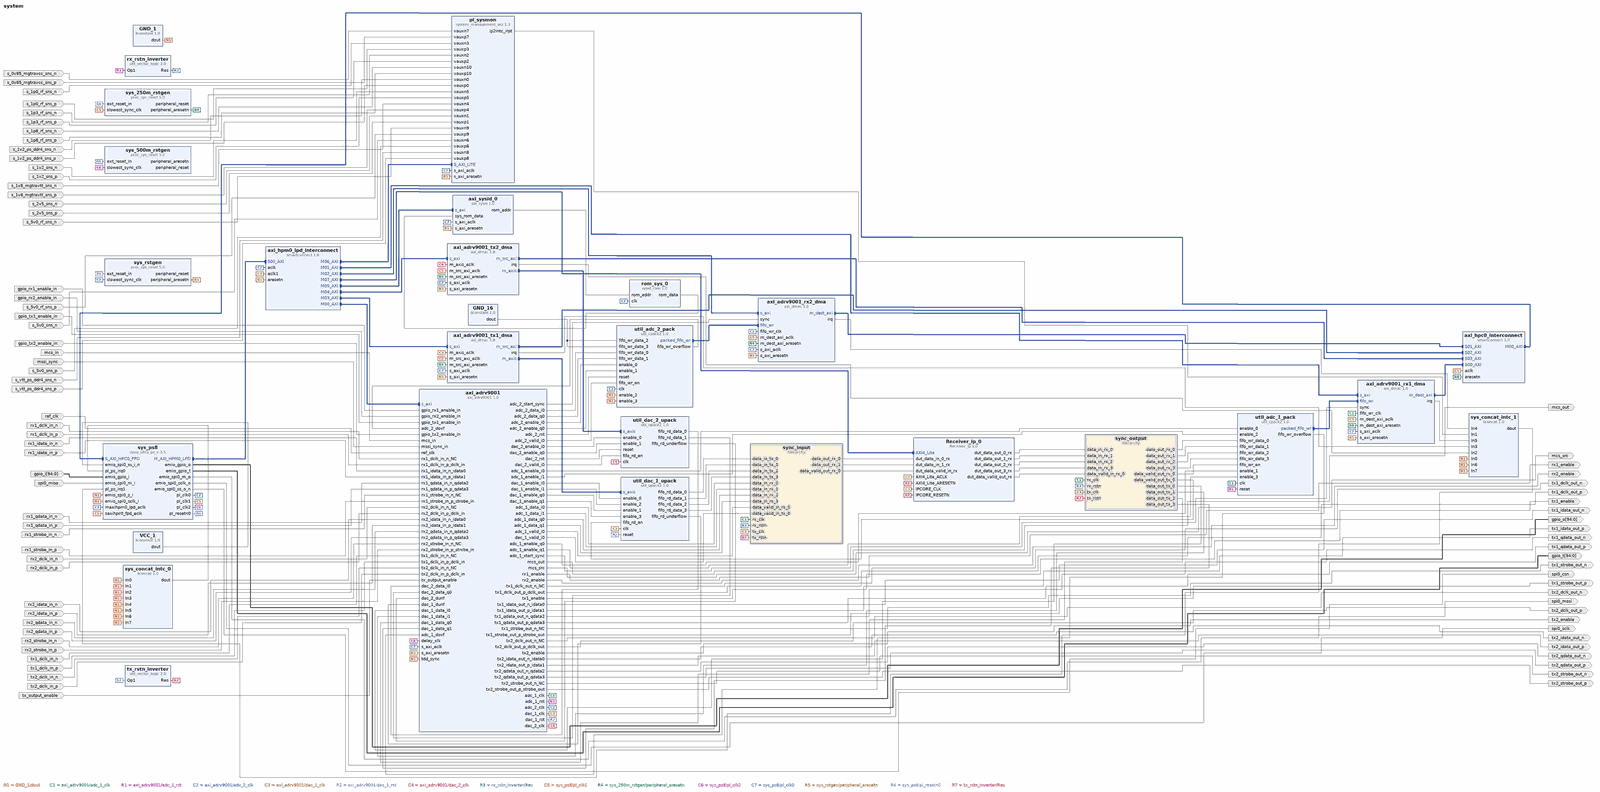
[diagram p0: block diagram of the top level, whole]
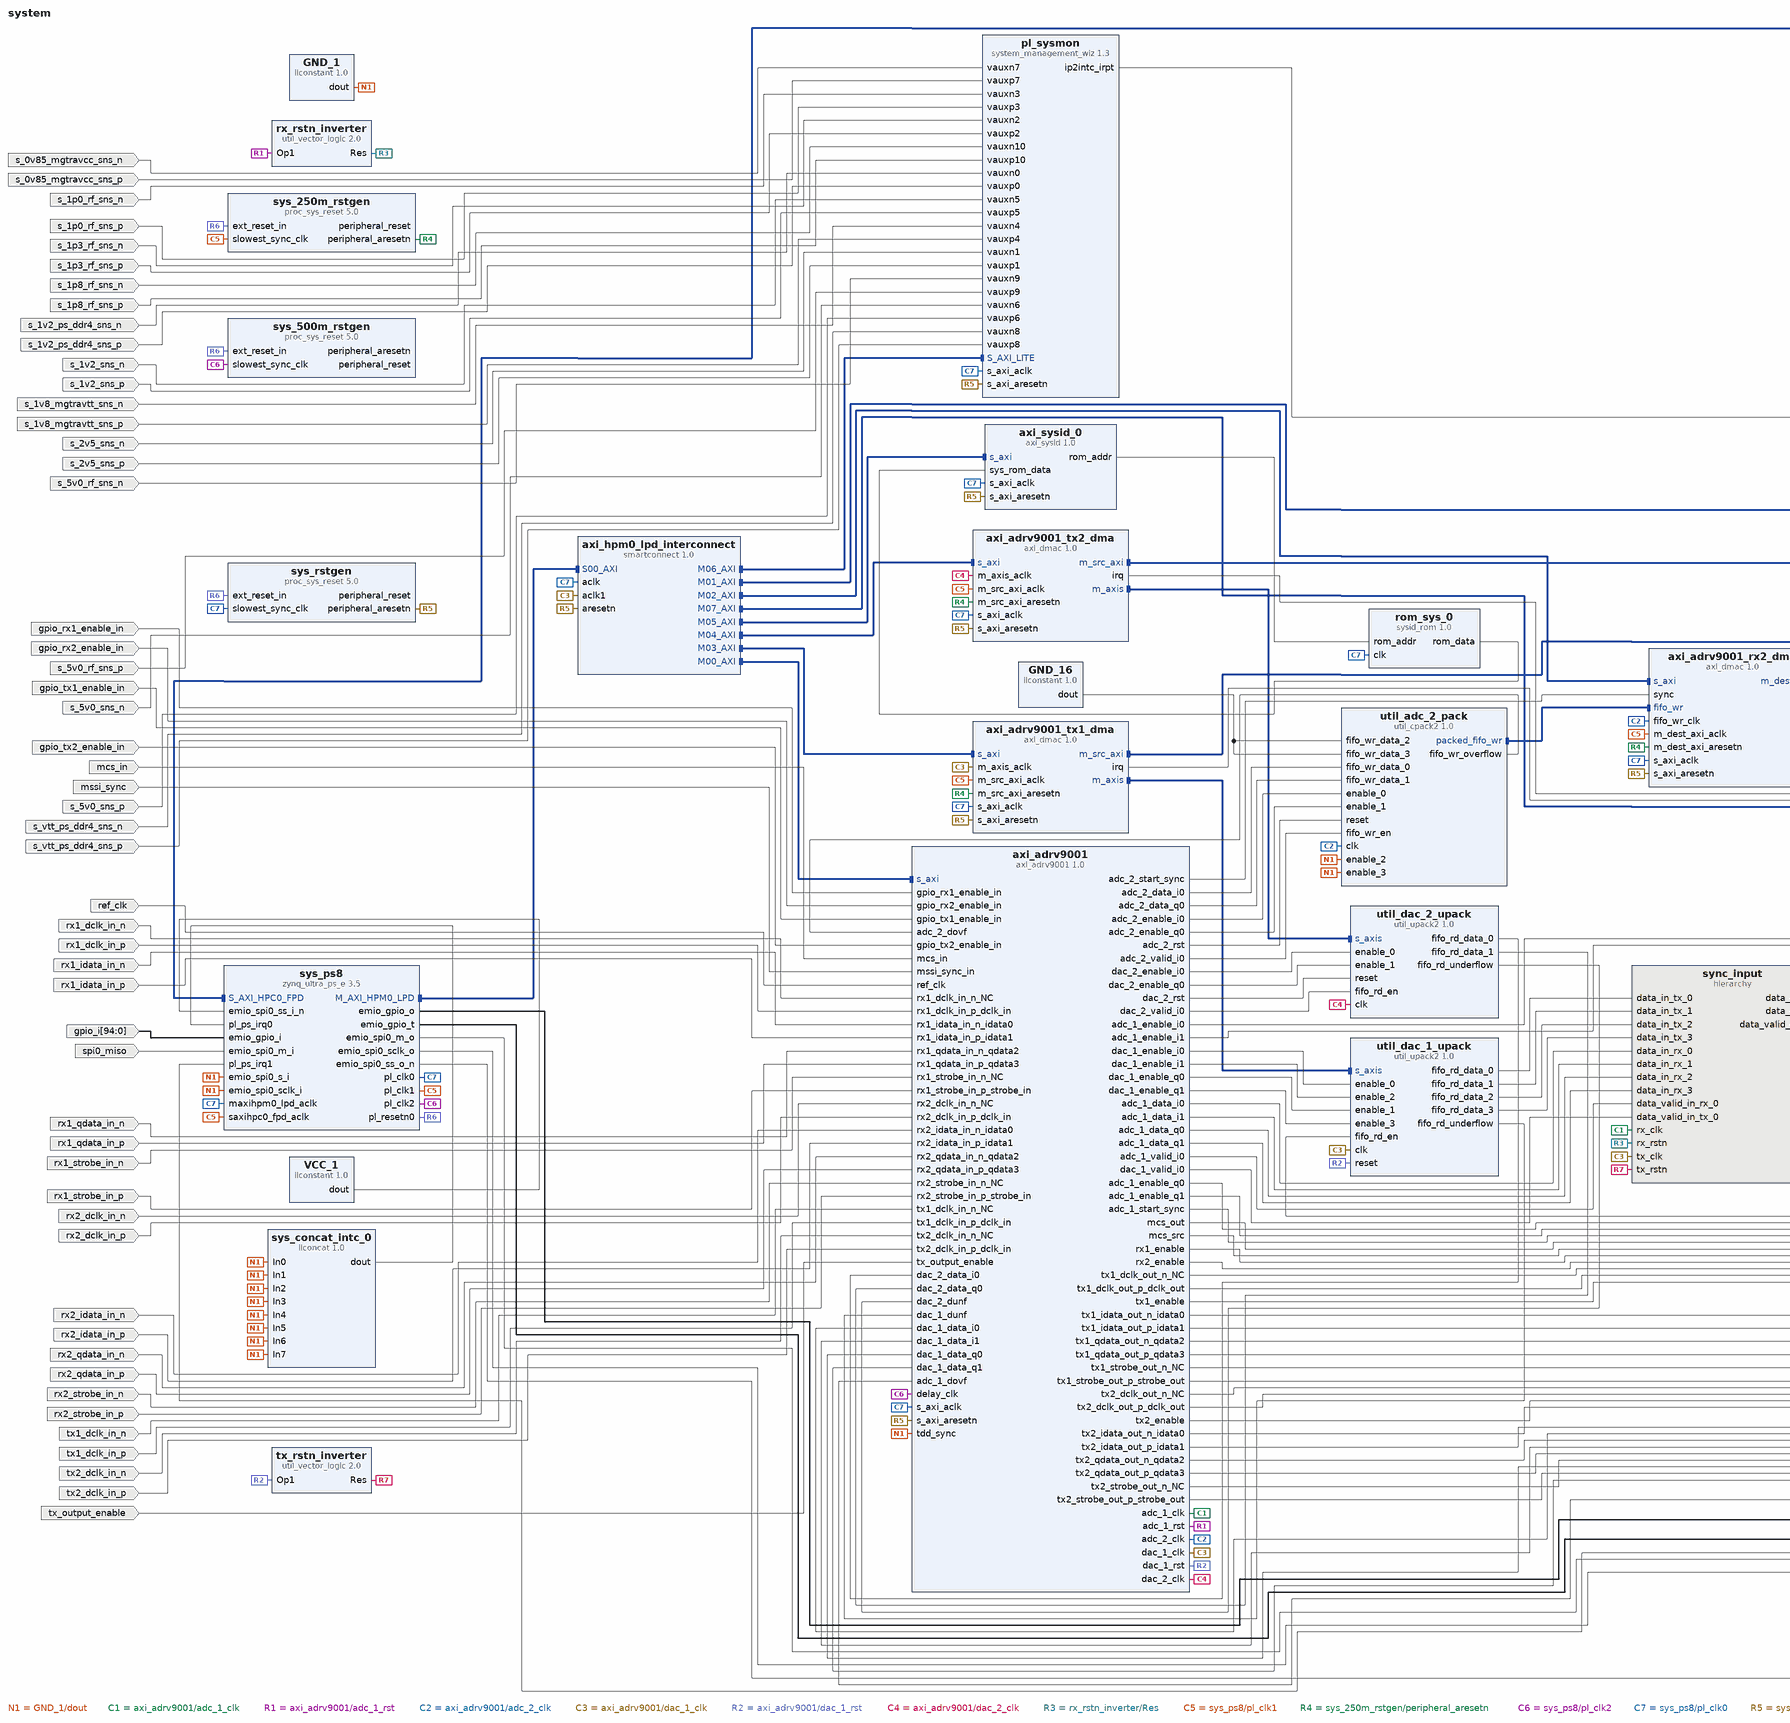
[diagram p1: block diagram of the top level, left part]
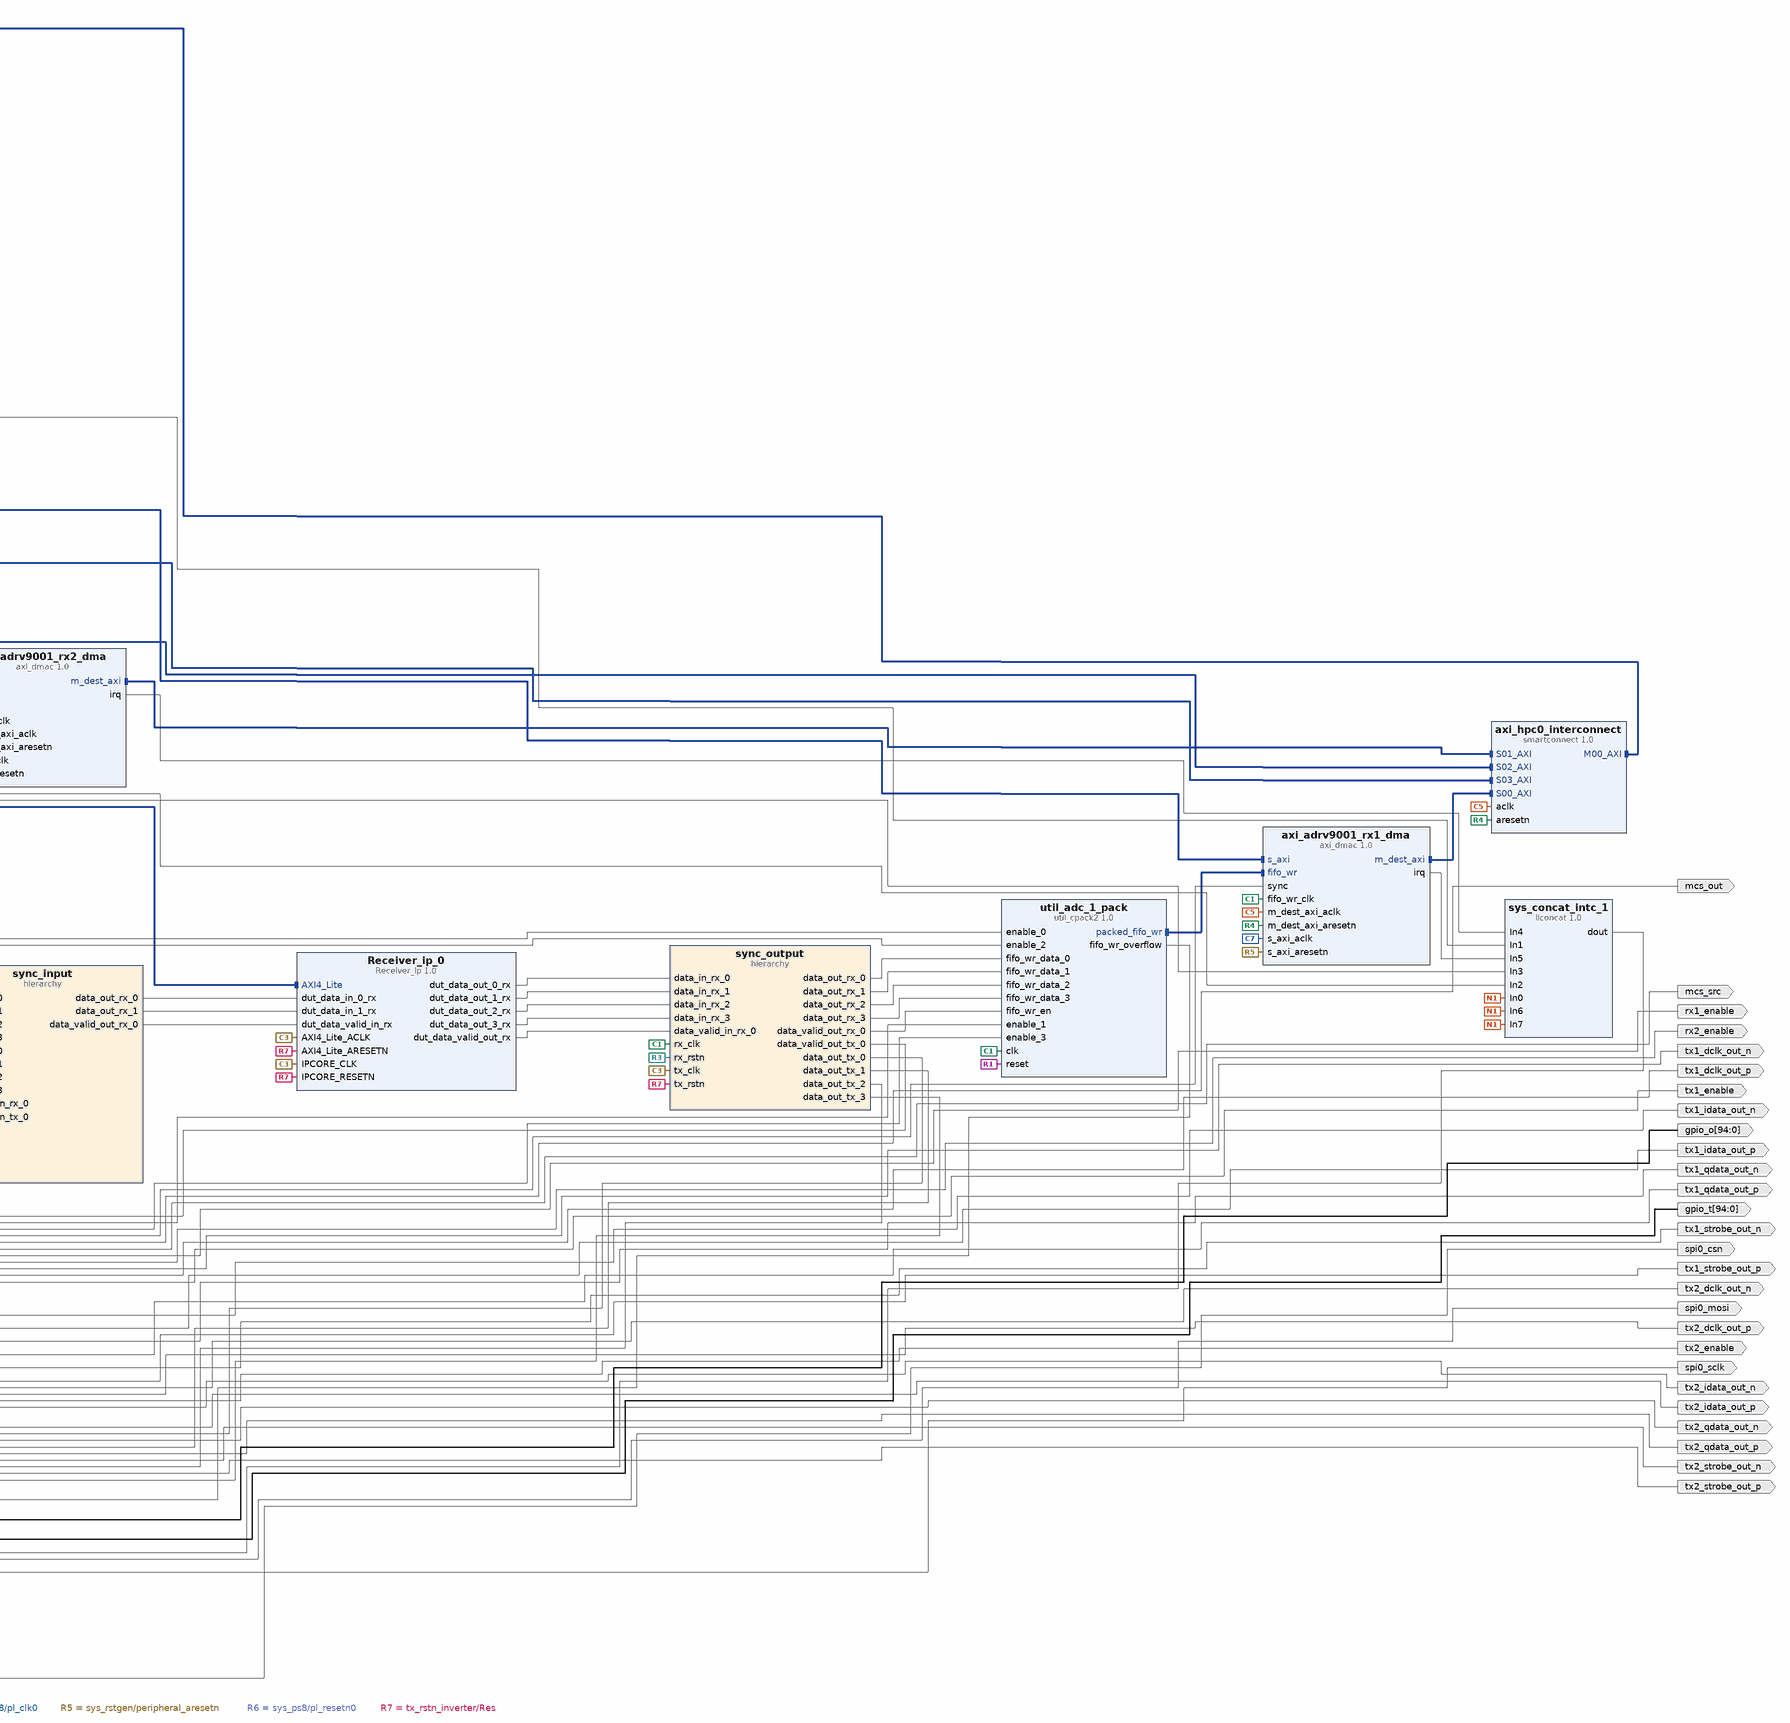
[diagram p2: block diagram of the top level, right part]
# Vivado block design system, xczu3eg-sfva625-2-e, Vivado 2025.1
create_bd_design system

create_bd_port -dir O spi0_csn
create_bd_port -dir O spi0_sclk
create_bd_port -dir O spi0_mosi
create_bd_port -dir I spi0_miso
create_bd_port -dir I -from 94 -to 0 gpio_i
create_bd_port -dir O -from 94 -to 0 gpio_o
create_bd_port -dir O -from 94 -to 0 gpio_t
create_bd_port -dir I rx1_dclk_in_n
create_bd_port -dir I rx1_dclk_in_p
create_bd_port -dir I rx1_idata_in_n
create_bd_port -dir I rx1_idata_in_p
create_bd_port -dir I rx1_qdata_in_n
create_bd_port -dir I rx1_qdata_in_p
create_bd_port -dir I rx1_strobe_in_n
create_bd_port -dir I rx1_strobe_in_p
create_bd_port -dir I rx2_dclk_in_n
create_bd_port -dir I rx2_dclk_in_p
create_bd_port -dir I rx2_idata_in_n
create_bd_port -dir I rx2_idata_in_p
create_bd_port -dir I rx2_qdata_in_n
create_bd_port -dir I rx2_qdata_in_p
create_bd_port -dir I rx2_strobe_in_n
create_bd_port -dir I rx2_strobe_in_p
create_bd_port -dir O tx1_dclk_out_n
create_bd_port -dir O tx1_dclk_out_p
create_bd_port -dir I tx1_dclk_in_n
create_bd_port -dir I tx1_dclk_in_p
create_bd_port -dir O tx1_idata_out_n
create_bd_port -dir O tx1_idata_out_p
create_bd_port -dir O tx1_qdata_out_n
create_bd_port -dir O tx1_qdata_out_p
create_bd_port -dir O tx1_strobe_out_n
create_bd_port -dir O tx1_strobe_out_p
create_bd_port -dir O tx2_dclk_out_n
create_bd_port -dir O tx2_dclk_out_p
create_bd_port -dir I tx2_dclk_in_n
create_bd_port -dir I tx2_dclk_in_p
create_bd_port -dir O tx2_idata_out_n
create_bd_port -dir O tx2_idata_out_p
create_bd_port -dir O tx2_qdata_out_n
create_bd_port -dir O tx2_qdata_out_p
create_bd_port -dir O tx2_strobe_out_n
create_bd_port -dir O tx2_strobe_out_p
create_bd_port -dir O rx1_enable
create_bd_port -dir O rx2_enable
create_bd_port -dir O tx1_enable
create_bd_port -dir O tx2_enable
create_bd_port -dir I gpio_rx1_enable_in
create_bd_port -dir I gpio_rx2_enable_in
create_bd_port -dir I gpio_tx1_enable_in
create_bd_port -dir I gpio_tx2_enable_in
create_bd_port -dir I ref_clk
create_bd_port -dir I mcs_in
create_bd_port -dir O mcs_out
create_bd_port -dir O mcs_src
create_bd_port -dir I mssi_sync
create_bd_port -dir I tx_output_enable
create_bd_port -dir I s_1p0_rf_sns_p
create_bd_port -dir I s_1p0_rf_sns_n
create_bd_port -dir I s_1p8_rf_sns_p
create_bd_port -dir I s_1p8_rf_sns_n
create_bd_port -dir I s_1p3_rf_sns_p
create_bd_port -dir I s_1p3_rf_sns_n
create_bd_port -dir I s_5v0_rf_sns_p
create_bd_port -dir I s_5v0_rf_sns_n
create_bd_port -dir I s_2v5_sns_p
create_bd_port -dir I s_2v5_sns_n
create_bd_port -dir I s_vtt_ps_ddr4_sns_p
create_bd_port -dir I s_vtt_ps_ddr4_sns_n
create_bd_port -dir I s_1v2_ps_ddr4_sns_p
create_bd_port -dir I s_1v2_ps_ddr4_sns_n
create_bd_port -dir I s_0v85_mgtravcc_sns_p
create_bd_port -dir I s_0v85_mgtravcc_sns_n
create_bd_port -dir I s_5v0_sns_p
create_bd_port -dir I s_5v0_sns_n
create_bd_port -dir I s_1v2_sns_p
create_bd_port -dir I s_1v2_sns_n
create_bd_port -dir I s_1v8_mgtravtt_sns_p
create_bd_port -dir I s_1v8_mgtravtt_sns_n

create_bd_cell -type ip -vlnv xilinx.com:ip:zynq_ultra_ps_e:3.5 sys_ps8
set_property -dict [list \
  CONFIG.PSU_BANK_0_IO_STANDARD LVCMOS18 \
  CONFIG.PSU_BANK_1_IO_STANDARD LVCMOS18 \
  CONFIG.PSU_BANK_2_IO_STANDARD LVCMOS18 \
  CONFIG.PSU_BANK_3_IO_STANDARD LVCMOS18 \
  CONFIG.PSU_USB3__DUAL_CLOCK_ENABLE 1 \
  CONFIG.PSU__AFI0_COHERENCY 1 \
  CONFIG.PSU__CRF_APB__DDR_CTRL__FREQMHZ 1066 \
  CONFIG.PSU__CRF_APB__DDR_CTRL__SRCSEL DPLL \
  CONFIG.PSU__CRF_APB__DPDMA_REF_CTRL__SRCSEL APLL \
  CONFIG.PSU__CRF_APB__DP_AUDIO_REF_CTRL__SRCSEL RPLL \
  CONFIG.PSU__CRF_APB__DP_STC_REF_CTRL__SRCSEL RPLL \
  CONFIG.PSU__CRF_APB__DP_VIDEO_REF_CTRL__SRCSEL VPLL \
  CONFIG.PSU__CRF_APB__GDMA_REF_CTRL__SRCSEL APLL \
  CONFIG.PSU__CRF_APB__GPU_REF_CTRL__FREQMHZ 500 \
  CONFIG.PSU__CRF_APB__GPU_REF_CTRL__SRCSEL IOPLL \
  CONFIG.PSU__CRF_APB__TOPSW_MAIN_CTRL__SRCSEL DPLL \
  CONFIG.PSU__CRL_APB__PL0_REF_CTRL__FREQMHZ 100 \
  CONFIG.PSU__CRL_APB__PL0_REF_CTRL__SRCSEL IOPLL \
  CONFIG.PSU__CRL_APB__PL1_REF_CTRL__FREQMHZ 250 \
  CONFIG.PSU__CRL_APB__PL1_REF_CTRL__SRCSEL IOPLL \
  CONFIG.PSU__CRL_APB__PL2_REF_CTRL__FREQMHZ 500 \
  CONFIG.PSU__CRL_APB__PL2_REF_CTRL__SRCSEL IOPLL \
  CONFIG.PSU__CRL_APB__SPI0_REF_CTRL__FREQMHZ 100 \
  CONFIG.PSU__CRL_APB__USB3__ENABLE 1 \
  CONFIG.PSU__DDRC__BUS_WIDTH {32 Bit} \
  CONFIG.PSU__DDRC__DEVICE_CAPACITY {8192 MBits} \
  CONFIG.PSU__DDRC__DRAM_WIDTH {16 Bits} \
  CONFIG.PSU__DDRC__ECC Disabled \
  CONFIG.PSU__DDRC__SPEED_BIN DDR4_2133P \
  CONFIG.PSU__DDR_HIGH_ADDRESS_GUI_ENABLE 0 \
  CONFIG.PSU__DDR__INTERFACE__FREQMHZ 533.000 \
  CONFIG.PSU__DISPLAYPORT__LANE0__ENABLE 1 \
  CONFIG.PSU__DISPLAYPORT__LANE0__IO {GT Lane3} \
  CONFIG.PSU__DISPLAYPORT__LANE1__ENABLE 1 \
  CONFIG.PSU__DISPLAYPORT__LANE1__IO {GT Lane2} \
  CONFIG.PSU__DISPLAYPORT__PERIPHERAL__ENABLE 1 \
  CONFIG.PSU__DLL__ISUSED 1 \
  CONFIG.PSU__DPAUX__PERIPHERAL__ENABLE 1 \
  CONFIG.PSU__DPAUX__PERIPHERAL__IO {MIO 27 .. 30} \
  CONFIG.PSU__DP__LANE_SEL {Dual Higher} \
  CONFIG.PSU__DP__REF_CLK_FREQ 108 \
  CONFIG.PSU__DP__REF_CLK_SEL {Ref Clk1} \
  CONFIG.PSU__ENET3__FIFO__ENABLE 0 \
  CONFIG.PSU__ENET3__GRP_MDIO__ENABLE 1 \
  CONFIG.PSU__ENET3__GRP_MDIO__IO {MIO 76 .. 77} \
  CONFIG.PSU__ENET3__PERIPHERAL__ENABLE 1 \
  CONFIG.PSU__ENET3__PERIPHERAL__IO {MIO 64 .. 75} \
  CONFIG.PSU__ENET3__PTP__ENABLE 0 \
  CONFIG.PSU__ENET3__TSU__ENABLE 0 \
  CONFIG.PSU__FPGA_PL0_ENABLE 1 \
  CONFIG.PSU__FPGA_PL1_ENABLE 1 \
  CONFIG.PSU__FPGA_PL2_ENABLE 1 \
  CONFIG.PSU__GEM3_COHERENCY 0 \
  CONFIG.PSU__GEM3_ROUTE_THROUGH_FPD 0 \
  CONFIG.PSU__GEM__TSU__ENABLE 0 \
  CONFIG.PSU__GPIO0_MIO__IO {MIO 0 .. 25} \
  CONFIG.PSU__GPIO0_MIO__PERIPHERAL__ENABLE 1 \
  CONFIG.PSU__GPIO1_MIO__IO {MIO 26 .. 51} \
  CONFIG.PSU__GPIO1_MIO__PERIPHERAL__ENABLE 1 \
  CONFIG.PSU__GPIO2_MIO__IO {MIO 52 .. 77} \
  CONFIG.PSU__GPIO2_MIO__PERIPHERAL__ENABLE 1 \
  CONFIG.PSU__GPIO_EMIO_WIDTH 95 \
  CONFIG.PSU__GPIO_EMIO__PERIPHERAL__ENABLE 1 \
  CONFIG.PSU__GPIO_EMIO__PERIPHERAL__IO 95 \
  CONFIG.PSU__GT__LINK_SPEED HBR \
  CONFIG.PSU__GT__PRE_EMPH_LVL_4 0 \
  CONFIG.PSU__GT__VLT_SWNG_LVL_4 0 \
  CONFIG.PSU__I2C0__PERIPHERAL__ENABLE 0 \
  CONFIG.PSU__I2C1__PERIPHERAL__ENABLE 1 \
  CONFIG.PSU__I2C1__PERIPHERAL__IO {MIO 32 .. 33} \
  CONFIG.PSU__PMU__PERIPHERAL__ENABLE 0 \
  CONFIG.PSU__QSPI_COHERENCY 0 \
  CONFIG.PSU__QSPI_ROUTE_THROUGH_FPD 0 \
  CONFIG.PSU__QSPI__GRP_FBCLK__ENABLE 0 \
  CONFIG.PSU__QSPI__PERIPHERAL__DATA_MODE x4 \
  CONFIG.PSU__QSPI__PERIPHERAL__ENABLE 1 \
  CONFIG.PSU__QSPI__PERIPHERAL__IO {MIO 0 .. 12} \
  CONFIG.PSU__QSPI__PERIPHERAL__MODE {Dual Parallel} \
  CONFIG.PSU__SATA__LANE1__IO {GT Lane1} \
  CONFIG.PSU__SATA__PERIPHERAL__ENABLE 1 \
  CONFIG.PSU__SATA__REF_CLK_FREQ 150 \
  CONFIG.PSU__SATA__REF_CLK_SEL {Ref Clk2} \
  CONFIG.PSU__SD1_COHERENCY 0 \
  CONFIG.PSU__SD1_ROUTE_THROUGH_FPD 0 \
  CONFIG.PSU__SD1__CLK_100_SDR_OTAP_DLY 0x3 \
  CONFIG.PSU__SD1__CLK_200_SDR_OTAP_DLY 0x3 \
  CONFIG.PSU__SD1__CLK_50_DDR_ITAP_DLY 0x33 \
  CONFIG.PSU__SD1__CLK_50_DDR_OTAP_DLY 0x4 \
  CONFIG.PSU__SD1__CLK_50_SDR_ITAP_DLY 0x28 \
  CONFIG.PSU__SD1__CLK_50_SDR_OTAP_DLY 0x5 \
  CONFIG.PSU__SD1__DATA_TRANSFER_MODE 8Bit \
  CONFIG.PSU__SD1__GRP_CD__ENABLE 1 \
  CONFIG.PSU__SD1__GRP_CD__IO {MIO 45} \
  CONFIG.PSU__SD1__GRP_POW__ENABLE 0 \
  CONFIG.PSU__SD1__GRP_WP__ENABLE 0 \
  CONFIG.PSU__SD1__PERIPHERAL__ENABLE 1 \
  CONFIG.PSU__SD1__PERIPHERAL__IO {MIO 39 46 .. 51} \
  CONFIG.PSU__SD1__SLOT_TYPE {SD 3.0 AUTODIR} \
  CONFIG.PSU__SPI0__GRP_SS0__IO EMIO \
  CONFIG.PSU__SPI0__PERIPHERAL__ENABLE 1 \
  CONFIG.PSU__SPI0__PERIPHERAL__IO EMIO \
  CONFIG.PSU__SPI1__GRP_SS0__IO {MIO 21} \
  CONFIG.PSU__SPI1__PERIPHERAL__ENABLE 1 \
  CONFIG.PSU__SPI1__PERIPHERAL__IO {MIO 18 .. 23} \
  CONFIG.PSU__SWDT0__CLOCK__ENABLE 0 \
  CONFIG.PSU__SWDT0__PERIPHERAL__ENABLE 1 \
  CONFIG.PSU__SWDT0__RESET__ENABLE 0 \
  CONFIG.PSU__SWDT1__CLOCK__ENABLE 0 \
  CONFIG.PSU__SWDT1__PERIPHERAL__ENABLE 1 \
  CONFIG.PSU__SWDT1__RESET__ENABLE 0 \
  CONFIG.PSU__TSU__BUFG_PORT_PAIR 0 \
  CONFIG.PSU__TTC0__CLOCK__ENABLE 0 \
  CONFIG.PSU__TTC0__PERIPHERAL__ENABLE 1 \
  CONFIG.PSU__TTC0__WAVEOUT__ENABLE 0 \
  CONFIG.PSU__TTC1__CLOCK__ENABLE 0 \
  CONFIG.PSU__TTC1__PERIPHERAL__ENABLE 1 \
  CONFIG.PSU__TTC1__WAVEOUT__ENABLE 0 \
  CONFIG.PSU__TTC2__CLOCK__ENABLE 0 \
  CONFIG.PSU__TTC2__PERIPHERAL__ENABLE 1 \
  CONFIG.PSU__TTC2__WAVEOUT__ENABLE 0 \
  CONFIG.PSU__TTC3__CLOCK__ENABLE 0 \
  CONFIG.PSU__TTC3__PERIPHERAL__ENABLE 1 \
  CONFIG.PSU__TTC3__WAVEOUT__ENABLE 0 \
  CONFIG.PSU__UART1__BAUD_RATE 115200 \
  CONFIG.PSU__UART1__MODEM__ENABLE 0 \
  CONFIG.PSU__UART1__PERIPHERAL__ENABLE 1 \
  CONFIG.PSU__UART1__PERIPHERAL__IO {MIO 16 .. 17} \
  CONFIG.PSU__USB0_COHERENCY 1 \
  CONFIG.PSU__USB0__PERIPHERAL__ENABLE 1 \
  CONFIG.PSU__USB0__PERIPHERAL__IO {MIO 52 .. 63} \
  CONFIG.PSU__USB0__REF_CLK_FREQ 26 \
  CONFIG.PSU__USB0__REF_CLK_SEL {Ref Clk0} \
  CONFIG.PSU__USB2_0__EMIO__ENABLE 0 \
  CONFIG.PSU__USB3_0__EMIO__ENABLE 0 \
  CONFIG.PSU__USB3_0__PERIPHERAL__ENABLE 1 \
  CONFIG.PSU__USB3_0__PERIPHERAL__IO {GT Lane0} \
  CONFIG.PSU__USB__RESET__MODE {Boot Pin} \
  CONFIG.PSU__USB__RESET__POLARITY {Active Low} \
  CONFIG.PSU__USE__IRQ0 1 \
  CONFIG.PSU__USE__IRQ1 1 \
  CONFIG.PSU__USE__M_AXI_GP0 0 \
  CONFIG.PSU__USE__M_AXI_GP1 0 \
  CONFIG.PSU__USE__M_AXI_GP2 1 \
  CONFIG.PSU__USE__S_AXI_GP0 1 \
  CONFIG.SUBPRESET1 Custom \
] [get_bd_cells sys_ps8]
# 106 more settings of sys_ps8 are not shown: defaults, MIO pin electricals, DDR timing, and values the tool derives
create_bd_cell -type ip -vlnv xilinx.com:ip:proc_sys_reset:5.0 sys_rstgen
set_property -dict {CONFIG.C_EXT_RST_WIDTH 1} [get_bd_cells sys_rstgen]
create_bd_cell -type ip -vlnv xilinx.com:ip:proc_sys_reset:5.0 sys_250m_rstgen
set_property -dict {CONFIG.C_EXT_RST_WIDTH 1} [get_bd_cells sys_250m_rstgen]
create_bd_cell -type ip -vlnv xilinx.com:ip:proc_sys_reset:5.0 sys_500m_rstgen
set_property -dict {CONFIG.C_EXT_RST_WIDTH 1} [get_bd_cells sys_500m_rstgen]
create_bd_cell -type inline_hdl -vlnv xilinx.com:inline_hdl:ilconstant:1.0 VCC_1
set_property -dict {CONFIG.CONST_VAL 1 CONFIG.CONST_WIDTH 1} [get_bd_cells VCC_1]
create_bd_cell -type inline_hdl -vlnv xilinx.com:inline_hdl:ilconstant:1.0 GND_1
set_property -dict {CONFIG.CONST_VAL 0 CONFIG.CONST_WIDTH 1} [get_bd_cells GND_1]
create_bd_cell -type ip -vlnv analog.com:user:axi_sysid:1.0 axi_sysid_0
set_property -dict {CONFIG.ROM_ADDR_BITS 9} [get_bd_cells axi_sysid_0]
create_bd_cell -type ip -vlnv analog.com:user:sysid_rom:1.0 rom_sys_0
set_property -dict [list \
  CONFIG.PATH_TO_FILE /home/tcollins/dev/qpsk_ai/TransceiverToolbox/trx_examples/targeting/QPSKTxRxHDLExample/hdl_prj_jupiter_txrx/vivado_ip_prj/projects/jupiter_sdr/mem_init_sys.txt \
  CONFIG.ROM_ADDR_BITS 9 \
] [get_bd_cells rom_sys_0]
create_bd_cell -type inline_hdl -vlnv xilinx.com:inline_hdl:ilconcat:1.0 sys_concat_intc_0
set_property -dict {CONFIG.NUM_PORTS 8} [get_bd_cells sys_concat_intc_0]
create_bd_cell -type inline_hdl -vlnv xilinx.com:inline_hdl:ilconcat:1.0 sys_concat_intc_1
set_property -dict {CONFIG.NUM_PORTS 8} [get_bd_cells sys_concat_intc_1]
create_bd_cell -type ip -vlnv analog.com:user:axi_adrv9001:1.0 axi_adrv9001
set_property -dict [list \
  CONFIG.CMOS_LVDS_N 0 \
  CONFIG.EXT_SYNC 1 \
  CONFIG.USE_RX_CLK_FOR_TX1 0 \
  CONFIG.USE_RX_CLK_FOR_TX2 0 \
] [get_bd_cells axi_adrv9001]
create_bd_cell -type ip -vlnv analog.com:user:axi_dmac:1.0 axi_adrv9001_rx1_dma
set_property -dict [list \
  CONFIG.AXI_AXCACHE 0b1111 \
  CONFIG.AXI_AXPROT 0b010 \
  CONFIG.AXI_SLICE_DEST false \
  CONFIG.AXI_SLICE_SRC false \
  CONFIG.CACHE_COHERENT true \
  CONFIG.CYCLIC false \
  CONFIG.DMA_2D_TRANSFER false \
  CONFIG.DMA_DATA_WIDTH_SRC 64 \
  CONFIG.DMA_TYPE_DEST 0 \
  CONFIG.DMA_TYPE_SRC 2 \
  CONFIG.SYNC_TRANSFER_START true \
] [get_bd_cells axi_adrv9001_rx1_dma]
create_bd_cell -type ip -vlnv analog.com:user:util_cpack2:1.0 util_adc_1_pack
set_property -dict {CONFIG.NUM_OF_CHANNELS 4 CONFIG.SAMPLE_DATA_WIDTH 16} [get_bd_cells util_adc_1_pack]
create_bd_cell -type ip -vlnv analog.com:user:axi_dmac:1.0 axi_adrv9001_rx2_dma
set_property -dict [list \
  CONFIG.AXI_AXCACHE 0b1111 \
  CONFIG.AXI_AXPROT 0b010 \
  CONFIG.AXI_SLICE_DEST false \
  CONFIG.AXI_SLICE_SRC false \
  CONFIG.CACHE_COHERENT true \
  CONFIG.CYCLIC false \
  CONFIG.DMA_2D_TRANSFER false \
  CONFIG.DMA_DATA_WIDTH_SRC 64 \
  CONFIG.DMA_TYPE_DEST 0 \
  CONFIG.DMA_TYPE_SRC 2 \
  CONFIG.SYNC_TRANSFER_START true \
] [get_bd_cells axi_adrv9001_rx2_dma]
create_bd_cell -type ip -vlnv analog.com:user:util_cpack2:1.0 util_adc_2_pack
set_property -dict {CONFIG.NUM_OF_CHANNELS 4 CONFIG.SAMPLE_DATA_WIDTH 16} [get_bd_cells util_adc_2_pack]
create_bd_cell -type ip -vlnv analog.com:user:axi_dmac:1.0 axi_adrv9001_tx1_dma
set_property -dict [list \
  CONFIG.AXI_AXCACHE 0b1111 \
  CONFIG.AXI_AXPROT 0b010 \
  CONFIG.AXI_SLICE_DEST false \
  CONFIG.AXI_SLICE_SRC false \
  CONFIG.CACHE_COHERENT true \
  CONFIG.CYCLIC true \
  CONFIG.DMA_2D_TRANSFER false \
  CONFIG.DMA_DATA_WIDTH_DEST 64 \
  CONFIG.DMA_TYPE_DEST 1 \
  CONFIG.DMA_TYPE_SRC 0 \
  CONFIG.SYNC_TRANSFER_START false \
] [get_bd_cells axi_adrv9001_tx1_dma]
create_bd_cell -type ip -vlnv analog.com:user:util_upack2:1.0 util_dac_1_upack
set_property -dict {CONFIG.NUM_OF_CHANNELS 4 CONFIG.SAMPLE_DATA_WIDTH 16} [get_bd_cells util_dac_1_upack]
create_bd_cell -type ip -vlnv analog.com:user:axi_dmac:1.0 axi_adrv9001_tx2_dma
set_property -dict [list \
  CONFIG.AXI_AXCACHE 0b1111 \
  CONFIG.AXI_AXPROT 0b010 \
  CONFIG.AXI_SLICE_DEST false \
  CONFIG.AXI_SLICE_SRC false \
  CONFIG.CACHE_COHERENT true \
  CONFIG.CYCLIC true \
  CONFIG.DMA_2D_TRANSFER false \
  CONFIG.DMA_DATA_WIDTH_DEST 32 \
  CONFIG.DMA_TYPE_DEST 1 \
  CONFIG.DMA_TYPE_SRC 0 \
  CONFIG.SYNC_TRANSFER_START false \
] [get_bd_cells axi_adrv9001_tx2_dma]
create_bd_cell -type ip -vlnv analog.com:user:util_upack2:1.0 util_dac_2_upack
set_property -dict {CONFIG.NUM_OF_CHANNELS 2 CONFIG.SAMPLE_DATA_WIDTH 16} [get_bd_cells util_dac_2_upack]
create_bd_cell -type inline_hdl -vlnv xilinx.com:inline_hdl:ilconstant:1.0 GND_16
set_property -dict {CONFIG.CONST_VAL 0 CONFIG.CONST_WIDTH 16} [get_bd_cells GND_16]
create_bd_cell -type ip -vlnv xilinx.com:ip:system_management_wiz:1.3 pl_sysmon
set_property -dict [list \
  CONFIG.ANALOG_BANK_SELECTION 66 \
  CONFIG.CHANNEL_ENABLE_TEMPERATURE true \
  CONFIG.CHANNEL_ENABLE_VAUXP0_VAUXN0 true \
  CONFIG.CHANNEL_ENABLE_VAUXP10_VAUXN10 true \
  CONFIG.CHANNEL_ENABLE_VAUXP1_VAUXN1 true \
  CONFIG.CHANNEL_ENABLE_VAUXP2_VAUXN2 true \
  CONFIG.CHANNEL_ENABLE_VAUXP3_VAUXN3 true \
  CONFIG.CHANNEL_ENABLE_VAUXP4_VAUXN4 true \
  CONFIG.CHANNEL_ENABLE_VAUXP5_VAUXN5 true \
  CONFIG.CHANNEL_ENABLE_VAUXP6_VAUXN6 true \
  CONFIG.CHANNEL_ENABLE_VAUXP7_VAUXN7 true \
  CONFIG.CHANNEL_ENABLE_VAUXP8_VAUXN8 true \
  CONFIG.CHANNEL_ENABLE_VAUXP9_VAUXN9 true \
  CONFIG.CHANNEL_ENABLE_VBRAM false \
  CONFIG.CHANNEL_ENABLE_VCCAUX true \
  CONFIG.CHANNEL_ENABLE_VCCINT true \
  CONFIG.CHANNEL_ENABLE_VP_VN false \
  CONFIG.CHANNEL_ENABLE_VUSER0 true \
  CONFIG.CHANNEL_ENABLE_VUSER1 true \
  CONFIG.ENABLE_VCCPSAUX_ALARM false \
  CONFIG.ENABLE_VCCPSINTFP_ALARM false \
  CONFIG.ENABLE_VCCPSINTLP_ALARM false \
  CONFIG.OT_ALARM true \
  CONFIG.SELECT_USER_SUPPLY1 VCCO \
  CONFIG.USER_SUPPLY0_ALARM false \
  CONFIG.USER_SUPPLY0_BANK 66 \
  CONFIG.USER_SUPPLY1_BANK 26 \
  CONFIG.USER_TEMP_ALARM false \
  CONFIG.VAUXN0_LOC A8 \
  CONFIG.VAUXN10_LOC G6 \
  CONFIG.VAUXN1_LOC B8 \
  CONFIG.VAUXN2_LOC F7 \
  CONFIG.VAUXN3_LOC F8 \
  CONFIG.VAUXN4_LOC B2 \
  CONFIG.VAUXN5_LOC A2 \
  CONFIG.VAUXN6_LOC H3 \
  CONFIG.VAUXN7_LOC F3 \
  CONFIG.VAUXN8_LOC B5 \
  CONFIG.VAUXN9_LOC A5 \
  CONFIG.VAUXP0_LOC A9 \
  CONFIG.VAUXP10_LOC H6 \
  CONFIG.VAUXP1_LOC C8 \
  CONFIG.VAUXP2_LOC G7 \
  CONFIG.VAUXP3_LOC G8 \
  CONFIG.VAUXP4_LOC B3 \
  CONFIG.VAUXP5_LOC A3 \
  CONFIG.VAUXP6_LOC H4 \
  CONFIG.VAUXP7_LOC G3 \
  CONFIG.VAUXP8_LOC C5 \
  CONFIG.VAUXP9_LOC A6 \
  CONFIG.VCCAUX_ALARM false \
  CONFIG.VCCINT_ALARM false \
] [get_bd_cells pl_sysmon]
create_bd_cell -type ip -vlnv xilinx.com:ip:smartconnect:1.0 axi_hpm0_lpd_interconnect
set_property -dict {CONFIG.NUM_CLKS 2 CONFIG.NUM_MI 8 CONFIG.NUM_SI 1} [get_bd_cells axi_hpm0_lpd_interconnect]
create_bd_cell -type ip -vlnv xilinx.com:ip:smartconnect:1.0 axi_hpc0_interconnect
set_property -dict {CONFIG.NUM_MI 1 CONFIG.NUM_SI 4} [get_bd_cells axi_hpc0_interconnect]
create_bd_cell -type hier sync_input
create_bd_cell -type hier sync_output
create_bd_cell -type ip -vlnv xilinx.com:ip:util_vector_logic:2.0 rx_rstn_inverter
set_property -dict {CONFIG.C_OPERATION not CONFIG.C_SIZE 1} [get_bd_cells rx_rstn_inverter]
create_bd_cell -type ip -vlnv xilinx.com:ip:util_vector_logic:2.0 tx_rstn_inverter
set_property -dict {CONFIG.C_OPERATION not CONFIG.C_SIZE 1} [get_bd_cells tx_rstn_inverter]
create_bd_cell -type ip -vlnv user.org:ip:Receiver_ip:1.0 Receiver_ip_0

# ---- hierarchy /sync_input ----
current_bd_instance /sync_input
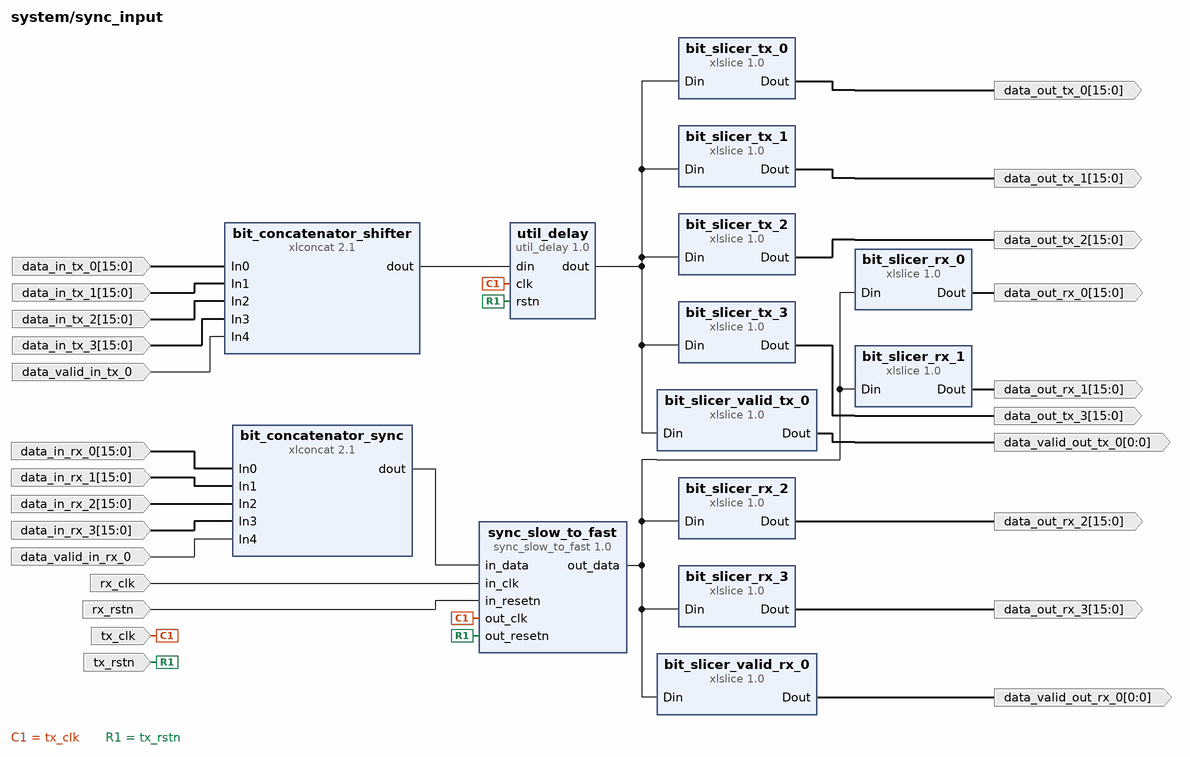
[diagram p3: block diagram inside /sync_input]
create_bd_pin -dir I rx_clk
create_bd_pin -dir I rx_rstn
create_bd_pin -dir I -from 15 -to 0 data_in_rx_0
create_bd_pin -dir O -from 15 -to 0 data_out_rx_0
create_bd_pin -dir I -from 15 -to 0 data_in_rx_1
create_bd_pin -dir O -from 15 -to 0 data_out_rx_1
create_bd_pin -dir I -from 15 -to 0 data_in_rx_2
create_bd_pin -dir O -from 15 -to 0 data_out_rx_2
create_bd_pin -dir I -from 15 -to 0 data_in_rx_3
create_bd_pin -dir O -from 15 -to 0 data_out_rx_3
create_bd_pin -dir I data_valid_in_rx_0
create_bd_pin -dir O -from 0 -to 0 data_valid_out_rx_0
create_bd_pin -dir I tx_clk
create_bd_pin -dir I tx_rstn
create_bd_pin -dir I -from 15 -to 0 data_in_tx_0
create_bd_pin -dir O -from 15 -to 0 data_out_tx_0
create_bd_pin -dir I -from 15 -to 0 data_in_tx_1
create_bd_pin -dir O -from 15 -to 0 data_out_tx_1
create_bd_pin -dir I -from 15 -to 0 data_in_tx_2
create_bd_pin -dir O -from 15 -to 0 data_out_tx_2
create_bd_pin -dir I -from 15 -to 0 data_in_tx_3
create_bd_pin -dir O -from 15 -to 0 data_out_tx_3
create_bd_pin -dir I data_valid_in_tx_0
create_bd_pin -dir O -from 0 -to 0 data_valid_out_tx_0

create_bd_cell -type ip -vlnv analog.com:user:sync_slow_to_fast:1.0 sync_slow_to_fast
set_property -dict {CONFIG.DEPTH 6 CONFIG.WIDTH 65} [get_bd_cells sync_slow_to_fast]
create_bd_cell -type ip -vlnv analog.com:user:util_delay:1.0 util_delay
set_property -dict {CONFIG.DATA_WIDTH 65 CONFIG.DELAY_CYCLES 4} [get_bd_cells util_delay]
create_bd_cell -type ip -vlnv xilinx.com:ip:xlconcat:2.1 bit_concatenator_sync
set_property -dict [list \
  CONFIG.IN0_WIDTH 16 \
  CONFIG.IN1_WIDTH 16 \
  CONFIG.IN2_WIDTH 16 \
  CONFIG.IN3_WIDTH 16 \
  CONFIG.IN4_WIDTH 1 \
  CONFIG.NUM_PORTS 5 \
] [get_bd_cells bit_concatenator_sync]
create_bd_cell -type ip -vlnv xilinx.com:ip:xlconcat:2.1 bit_concatenator_shifter
set_property -dict [list \
  CONFIG.IN0_WIDTH 16 \
  CONFIG.IN1_WIDTH 16 \
  CONFIG.IN2_WIDTH 16 \
  CONFIG.IN3_WIDTH 16 \
  CONFIG.IN4_WIDTH 1 \
  CONFIG.NUM_PORTS 5 \
] [get_bd_cells bit_concatenator_shifter]
create_bd_cell -type ip -vlnv xilinx.com:ip:xlslice:1.0 bit_slicer_rx_0
set_property -dict {CONFIG.DIN_FROM 15 CONFIG.DIN_TO 0 CONFIG.DIN_WIDTH 65} [get_bd_cells bit_slicer_rx_0]
create_bd_cell -type ip -vlnv xilinx.com:ip:xlslice:1.0 bit_slicer_tx_0
set_property -dict {CONFIG.DIN_FROM 15 CONFIG.DIN_TO 0 CONFIG.DIN_WIDTH 65} [get_bd_cells bit_slicer_tx_0]
create_bd_cell -type ip -vlnv xilinx.com:ip:xlslice:1.0 bit_slicer_rx_1
set_property -dict {CONFIG.DIN_FROM 31 CONFIG.DIN_TO 16 CONFIG.DIN_WIDTH 65} [get_bd_cells bit_slicer_rx_1]
create_bd_cell -type ip -vlnv xilinx.com:ip:xlslice:1.0 bit_slicer_tx_1
set_property -dict {CONFIG.DIN_FROM 31 CONFIG.DIN_TO 16 CONFIG.DIN_WIDTH 65} [get_bd_cells bit_slicer_tx_1]
create_bd_cell -type ip -vlnv xilinx.com:ip:xlslice:1.0 bit_slicer_rx_2
set_property -dict {CONFIG.DIN_FROM 47 CONFIG.DIN_TO 32 CONFIG.DIN_WIDTH 65} [get_bd_cells bit_slicer_rx_2]
create_bd_cell -type ip -vlnv xilinx.com:ip:xlslice:1.0 bit_slicer_tx_2
set_property -dict {CONFIG.DIN_FROM 47 CONFIG.DIN_TO 32 CONFIG.DIN_WIDTH 65} [get_bd_cells bit_slicer_tx_2]
create_bd_cell -type ip -vlnv xilinx.com:ip:xlslice:1.0 bit_slicer_rx_3
set_property -dict {CONFIG.DIN_FROM 63 CONFIG.DIN_TO 48 CONFIG.DIN_WIDTH 65} [get_bd_cells bit_slicer_rx_3]
create_bd_cell -type ip -vlnv xilinx.com:ip:xlslice:1.0 bit_slicer_tx_3
set_property -dict {CONFIG.DIN_FROM 63 CONFIG.DIN_TO 48 CONFIG.DIN_WIDTH 65} [get_bd_cells bit_slicer_tx_3]
create_bd_cell -type ip -vlnv xilinx.com:ip:xlslice:1.0 bit_slicer_valid_rx_0
set_property -dict {CONFIG.DIN_FROM 64 CONFIG.DIN_TO 64 CONFIG.DIN_WIDTH 65} [get_bd_cells bit_slicer_valid_rx_0]
create_bd_cell -type ip -vlnv xilinx.com:ip:xlslice:1.0 bit_slicer_valid_tx_0
set_property -dict {CONFIG.DIN_FROM 64 CONFIG.DIN_TO 64 CONFIG.DIN_WIDTH 65} [get_bd_cells bit_slicer_valid_tx_0]

# ---- hierarchy /sync_output ----
current_bd_instance /sync_output
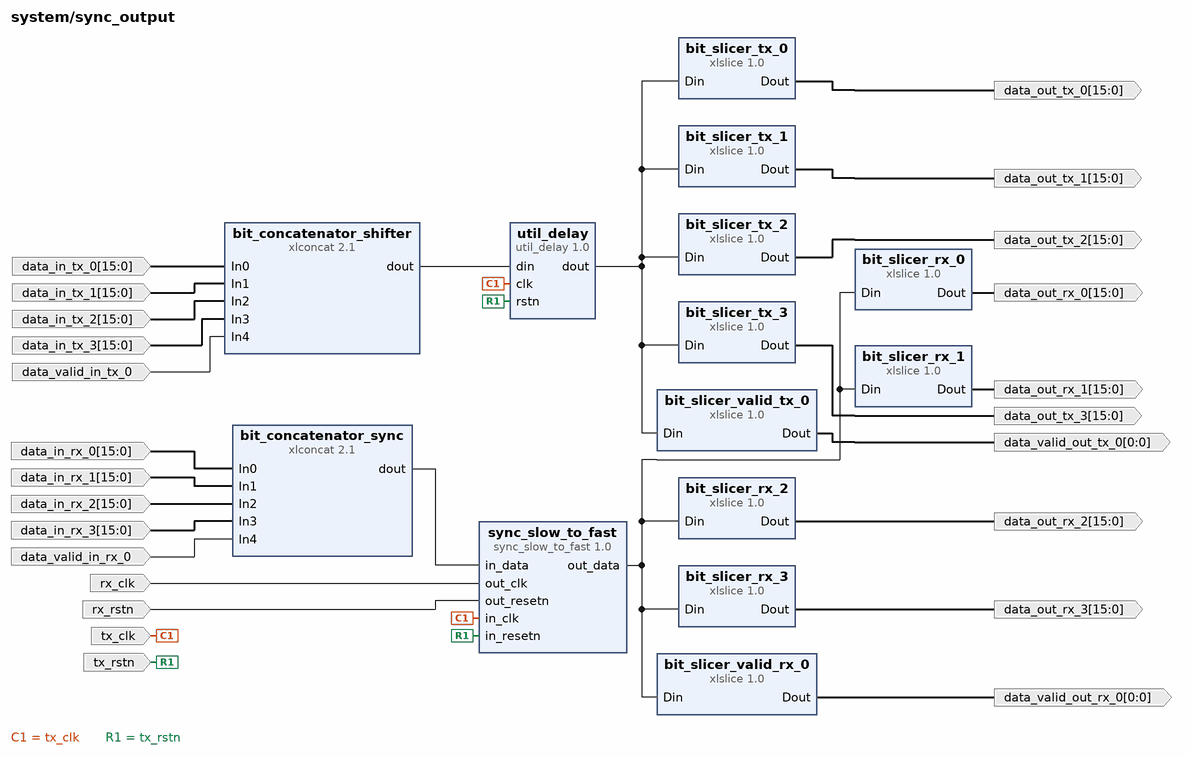
[diagram p4: block diagram inside /sync_output]
create_bd_pin -dir I rx_clk
create_bd_pin -dir I rx_rstn
create_bd_pin -dir I -from 15 -to 0 data_in_rx_0
create_bd_pin -dir O -from 15 -to 0 data_out_rx_0
create_bd_pin -dir I -from 15 -to 0 data_in_rx_1
create_bd_pin -dir O -from 15 -to 0 data_out_rx_1
create_bd_pin -dir I -from 15 -to 0 data_in_rx_2
create_bd_pin -dir O -from 15 -to 0 data_out_rx_2
create_bd_pin -dir I -from 15 -to 0 data_in_rx_3
create_bd_pin -dir O -from 15 -to 0 data_out_rx_3
create_bd_pin -dir I data_valid_in_rx_0
create_bd_pin -dir O -from 0 -to 0 data_valid_out_rx_0
create_bd_pin -dir I tx_clk
create_bd_pin -dir I tx_rstn
create_bd_pin -dir I -from 15 -to 0 data_in_tx_0
create_bd_pin -dir O -from 15 -to 0 data_out_tx_0
create_bd_pin -dir I -from 15 -to 0 data_in_tx_1
create_bd_pin -dir O -from 15 -to 0 data_out_tx_1
create_bd_pin -dir I -from 15 -to 0 data_in_tx_2
create_bd_pin -dir O -from 15 -to 0 data_out_tx_2
create_bd_pin -dir I -from 15 -to 0 data_in_tx_3
create_bd_pin -dir O -from 15 -to 0 data_out_tx_3
create_bd_pin -dir I data_valid_in_tx_0
create_bd_pin -dir O -from 0 -to 0 data_valid_out_tx_0

create_bd_cell -type ip -vlnv analog.com:user:sync_slow_to_fast:1.0 sync_slow_to_fast
set_property -dict {CONFIG.DEPTH 6 CONFIG.WIDTH 65} [get_bd_cells sync_slow_to_fast]
create_bd_cell -type ip -vlnv analog.com:user:util_delay:1.0 util_delay
set_property -dict {CONFIG.DATA_WIDTH 65 CONFIG.DELAY_CYCLES 4} [get_bd_cells util_delay]
create_bd_cell -type ip -vlnv xilinx.com:ip:xlconcat:2.1 bit_concatenator_sync
set_property -dict [list \
  CONFIG.IN0_WIDTH 16 \
  CONFIG.IN1_WIDTH 16 \
  CONFIG.IN2_WIDTH 16 \
  CONFIG.IN3_WIDTH 16 \
  CONFIG.IN4_WIDTH 1 \
  CONFIG.NUM_PORTS 5 \
] [get_bd_cells bit_concatenator_sync]
create_bd_cell -type ip -vlnv xilinx.com:ip:xlconcat:2.1 bit_concatenator_shifter
set_property -dict [list \
  CONFIG.IN0_WIDTH 16 \
  CONFIG.IN1_WIDTH 16 \
  CONFIG.IN2_WIDTH 16 \
  CONFIG.IN3_WIDTH 16 \
  CONFIG.IN4_WIDTH 1 \
  CONFIG.NUM_PORTS 5 \
] [get_bd_cells bit_concatenator_shifter]
create_bd_cell -type ip -vlnv xilinx.com:ip:xlslice:1.0 bit_slicer_rx_0
set_property -dict {CONFIG.DIN_FROM 15 CONFIG.DIN_TO 0 CONFIG.DIN_WIDTH 65} [get_bd_cells bit_slicer_rx_0]
create_bd_cell -type ip -vlnv xilinx.com:ip:xlslice:1.0 bit_slicer_tx_0
set_property -dict {CONFIG.DIN_FROM 15 CONFIG.DIN_TO 0 CONFIG.DIN_WIDTH 65} [get_bd_cells bit_slicer_tx_0]
create_bd_cell -type ip -vlnv xilinx.com:ip:xlslice:1.0 bit_slicer_rx_1
set_property -dict {CONFIG.DIN_FROM 31 CONFIG.DIN_TO 16 CONFIG.DIN_WIDTH 65} [get_bd_cells bit_slicer_rx_1]
create_bd_cell -type ip -vlnv xilinx.com:ip:xlslice:1.0 bit_slicer_tx_1
set_property -dict {CONFIG.DIN_FROM 31 CONFIG.DIN_TO 16 CONFIG.DIN_WIDTH 65} [get_bd_cells bit_slicer_tx_1]
create_bd_cell -type ip -vlnv xilinx.com:ip:xlslice:1.0 bit_slicer_rx_2
set_property -dict {CONFIG.DIN_FROM 47 CONFIG.DIN_TO 32 CONFIG.DIN_WIDTH 65} [get_bd_cells bit_slicer_rx_2]
create_bd_cell -type ip -vlnv xilinx.com:ip:xlslice:1.0 bit_slicer_tx_2
set_property -dict {CONFIG.DIN_FROM 47 CONFIG.DIN_TO 32 CONFIG.DIN_WIDTH 65} [get_bd_cells bit_slicer_tx_2]
create_bd_cell -type ip -vlnv xilinx.com:ip:xlslice:1.0 bit_slicer_rx_3
set_property -dict {CONFIG.DIN_FROM 63 CONFIG.DIN_TO 48 CONFIG.DIN_WIDTH 65} [get_bd_cells bit_slicer_rx_3]
create_bd_cell -type ip -vlnv xilinx.com:ip:xlslice:1.0 bit_slicer_tx_3
set_property -dict {CONFIG.DIN_FROM 63 CONFIG.DIN_TO 48 CONFIG.DIN_WIDTH 65} [get_bd_cells bit_slicer_tx_3]
create_bd_cell -type ip -vlnv xilinx.com:ip:xlslice:1.0 bit_slicer_valid_rx_0
set_property -dict {CONFIG.DIN_FROM 64 CONFIG.DIN_TO 64 CONFIG.DIN_WIDTH 65} [get_bd_cells bit_slicer_valid_rx_0]
create_bd_cell -type ip -vlnv xilinx.com:ip:xlslice:1.0 bit_slicer_valid_tx_0
set_property -dict {CONFIG.DIN_FROM 64 CONFIG.DIN_TO 64 CONFIG.DIN_WIDTH 65} [get_bd_cells bit_slicer_valid_tx_0]

# ---- connections ----

current_bd_instance /sync_input
connect_bd_net [get_bd_pins bit_concatenator_shifter/dout] [get_bd_pins util_delay/din]
connect_bd_net [get_bd_pins bit_concatenator_sync/dout] [get_bd_pins sync_slow_to_fast/in_data]
connect_bd_net [get_bd_pins bit_slicer_rx_0/Dout] [get_bd_pins data_out_rx_0]
connect_bd_net [get_bd_pins bit_slicer_rx_1/Dout] [get_bd_pins data_out_rx_1]
connect_bd_net [get_bd_pins bit_slicer_rx_2/Dout] [get_bd_pins data_out_rx_2]
connect_bd_net [get_bd_pins bit_slicer_rx_3/Dout] [get_bd_pins data_out_rx_3]
connect_bd_net [get_bd_pins bit_slicer_tx_0/Dout] [get_bd_pins data_out_tx_0]
connect_bd_net [get_bd_pins bit_slicer_tx_1/Dout] [get_bd_pins data_out_tx_1]
connect_bd_net [get_bd_pins bit_slicer_tx_2/Dout] [get_bd_pins data_out_tx_2]
connect_bd_net [get_bd_pins bit_slicer_tx_3/Dout] [get_bd_pins data_out_tx_3]
connect_bd_net [get_bd_pins bit_slicer_valid_rx_0/Dout] [get_bd_pins data_valid_out_rx_0]
connect_bd_net [get_bd_pins bit_slicer_valid_tx_0/Dout] [get_bd_pins data_valid_out_tx_0]
connect_bd_net -net data_in_rx_0_1 [get_bd_pins data_in_rx_0] [get_bd_pins bit_concatenator_sync/In0]
connect_bd_net -net data_in_rx_1_1 [get_bd_pins data_in_rx_1] [get_bd_pins bit_concatenator_sync/In1]
connect_bd_net -net data_in_rx_2_1 [get_bd_pins data_in_rx_2] [get_bd_pins bit_concatenator_sync/In2]
connect_bd_net -net data_in_rx_3_1 [get_bd_pins data_in_rx_3] [get_bd_pins bit_concatenator_sync/In3]
connect_bd_net -net data_in_tx_0_1 [get_bd_pins data_in_tx_0] [get_bd_pins bit_concatenator_shifter/In0]
connect_bd_net -net data_in_tx_1_1 [get_bd_pins data_in_tx_1] [get_bd_pins bit_concatenator_shifter/In1]
connect_bd_net -net data_in_tx_2_1 [get_bd_pins data_in_tx_2] [get_bd_pins bit_concatenator_shifter/In2]
connect_bd_net -net data_in_tx_3_1 [get_bd_pins data_in_tx_3] [get_bd_pins bit_concatenator_shifter/In3]
connect_bd_net -net data_valid_in_rx_0_1 [get_bd_pins data_valid_in_rx_0] [get_bd_pins bit_concatenator_sync/In4]
connect_bd_net -net data_valid_in_tx_0_1 [get_bd_pins data_valid_in_tx_0] [get_bd_pins bit_concatenator_shifter/In4]
connect_bd_net [get_bd_pins rx_clk] [get_bd_pins sync_slow_to_fast/in_clk]
connect_bd_net [get_bd_pins rx_rstn] [get_bd_pins sync_slow_to_fast/in_resetn]
connect_bd_net [get_bd_pins sync_slow_to_fast/out_data] \
  [get_bd_pins bit_slicer_rx_0/Din] [get_bd_pins bit_slicer_rx_1/Din] [get_bd_pins bit_slicer_rx_2/Din] \
  [get_bd_pins bit_slicer_rx_3/Din] [get_bd_pins bit_slicer_valid_rx_0/Din]
connect_bd_net [get_bd_pins tx_clk] [get_bd_pins util_delay/clk] [get_bd_pins sync_slow_to_fast/out_clk]
connect_bd_net [get_bd_pins tx_rstn] [get_bd_pins util_delay/rstn] [get_bd_pins sync_slow_to_fast/out_resetn]
connect_bd_net [get_bd_pins util_delay/dout] \
  [get_bd_pins bit_slicer_tx_0/Din] [get_bd_pins bit_slicer_tx_1/Din] [get_bd_pins bit_slicer_tx_2/Din] \
  [get_bd_pins bit_slicer_tx_3/Din] [get_bd_pins bit_slicer_valid_tx_0/Din]

current_bd_instance /sync_output
connect_bd_net [get_bd_pins bit_concatenator_shifter/dout] [get_bd_pins util_delay/din]
connect_bd_net [get_bd_pins bit_concatenator_sync/dout] [get_bd_pins sync_slow_to_fast/in_data]
connect_bd_net [get_bd_pins bit_slicer_rx_0/Dout] [get_bd_pins data_out_rx_0]
connect_bd_net [get_bd_pins bit_slicer_rx_1/Dout] [get_bd_pins data_out_rx_1]
connect_bd_net [get_bd_pins bit_slicer_rx_2/Dout] [get_bd_pins data_out_rx_2]
connect_bd_net [get_bd_pins bit_slicer_rx_3/Dout] [get_bd_pins data_out_rx_3]
connect_bd_net [get_bd_pins bit_slicer_tx_0/Dout] [get_bd_pins data_out_tx_0]
connect_bd_net [get_bd_pins bit_slicer_tx_1/Dout] [get_bd_pins data_out_tx_1]
connect_bd_net [get_bd_pins bit_slicer_tx_2/Dout] [get_bd_pins data_out_tx_2]
connect_bd_net [get_bd_pins bit_slicer_tx_3/Dout] [get_bd_pins data_out_tx_3]
connect_bd_net [get_bd_pins bit_slicer_valid_rx_0/Dout] [get_bd_pins data_valid_out_rx_0]
connect_bd_net [get_bd_pins bit_slicer_valid_tx_0/Dout] [get_bd_pins data_valid_out_tx_0]
connect_bd_net -net data_in_rx_0_1 [get_bd_pins data_in_rx_0] [get_bd_pins bit_concatenator_sync/In0]
connect_bd_net -net data_in_rx_1_1 [get_bd_pins data_in_rx_1] [get_bd_pins bit_concatenator_sync/In1]
connect_bd_net -net data_in_rx_2_1 [get_bd_pins data_in_rx_2] [get_bd_pins bit_concatenator_sync/In2]
connect_bd_net -net data_in_rx_3_1 [get_bd_pins data_in_rx_3] [get_bd_pins bit_concatenator_sync/In3]
connect_bd_net -net data_in_tx_0_1 [get_bd_pins data_in_tx_0] [get_bd_pins bit_concatenator_shifter/In0]
connect_bd_net -net data_in_tx_1_1 [get_bd_pins data_in_tx_1] [get_bd_pins bit_concatenator_shifter/In1]
connect_bd_net -net data_in_tx_2_1 [get_bd_pins data_in_tx_2] [get_bd_pins bit_concatenator_shifter/In2]
connect_bd_net -net data_in_tx_3_1 [get_bd_pins data_in_tx_3] [get_bd_pins bit_concatenator_shifter/In3]
connect_bd_net -net data_valid_in_rx_0_1 [get_bd_pins data_valid_in_rx_0] [get_bd_pins bit_concatenator_sync/In4]
connect_bd_net -net data_valid_in_tx_0_1 [get_bd_pins data_valid_in_tx_0] [get_bd_pins bit_concatenator_shifter/In4]
connect_bd_net [get_bd_pins rx_clk] [get_bd_pins sync_slow_to_fast/out_clk]
connect_bd_net [get_bd_pins rx_rstn] [get_bd_pins sync_slow_to_fast/out_resetn]
connect_bd_net [get_bd_pins sync_slow_to_fast/out_data] \
  [get_bd_pins bit_slicer_rx_0/Din] [get_bd_pins bit_slicer_rx_1/Din] [get_bd_pins bit_slicer_rx_2/Din] \
  [get_bd_pins bit_slicer_rx_3/Din] [get_bd_pins bit_slicer_valid_rx_0/Din]
connect_bd_net [get_bd_pins tx_clk] [get_bd_pins util_delay/clk] [get_bd_pins sync_slow_to_fast/in_clk]
connect_bd_net [get_bd_pins tx_rstn] [get_bd_pins util_delay/rstn] [get_bd_pins sync_slow_to_fast/in_resetn]
connect_bd_net [get_bd_pins util_delay/dout] \
  [get_bd_pins bit_slicer_tx_0/Din] [get_bd_pins bit_slicer_tx_1/Din] [get_bd_pins bit_slicer_tx_2/Din] \
  [get_bd_pins bit_slicer_tx_3/Din] [get_bd_pins bit_slicer_valid_tx_0/Din]

current_bd_instance /
connect_bd_intf_net [get_bd_intf_pins axi_hpc0_interconnect/S00_AXI] [get_bd_intf_pins axi_adrv9001_rx1_dma/m_dest_axi]
connect_bd_intf_net [get_bd_intf_pins axi_hpc0_interconnect/S01_AXI] [get_bd_intf_pins axi_adrv9001_rx2_dma/m_dest_axi]
connect_bd_intf_net [get_bd_intf_pins axi_adrv9001_tx1_dma/m_axis] [get_bd_intf_pins util_dac_1_upack/s_axis]
connect_bd_intf_net [get_bd_intf_pins axi_hpc0_interconnect/S02_AXI] [get_bd_intf_pins axi_adrv9001_tx1_dma/m_src_axi]
connect_bd_intf_net [get_bd_intf_pins axi_adrv9001_tx2_dma/m_axis] [get_bd_intf_pins util_dac_2_upack/s_axis]
connect_bd_intf_net [get_bd_intf_pins axi_hpc0_interconnect/S03_AXI] [get_bd_intf_pins axi_adrv9001_tx2_dma/m_src_axi]
connect_bd_intf_net [get_bd_intf_pins axi_hpc0_interconnect/M00_AXI] [get_bd_intf_pins sys_ps8/S_AXI_HPC0_FPD]
connect_bd_intf_net [get_bd_intf_pins axi_hpm0_lpd_interconnect/M00_AXI] [get_bd_intf_pins axi_adrv9001/s_axi]
connect_bd_intf_net [get_bd_intf_pins axi_hpm0_lpd_interconnect/M01_AXI] [get_bd_intf_pins axi_adrv9001_rx1_dma/s_axi]
connect_bd_intf_net [get_bd_intf_pins axi_hpm0_lpd_interconnect/M02_AXI] [get_bd_intf_pins axi_adrv9001_rx2_dma/s_axi]
connect_bd_intf_net [get_bd_intf_pins axi_hpm0_lpd_interconnect/M03_AXI] [get_bd_intf_pins axi_adrv9001_tx1_dma/s_axi]
connect_bd_intf_net [get_bd_intf_pins axi_hpm0_lpd_interconnect/M04_AXI] [get_bd_intf_pins axi_adrv9001_tx2_dma/s_axi]
connect_bd_intf_net [get_bd_intf_pins axi_hpm0_lpd_interconnect/M05_AXI] [get_bd_intf_pins axi_sysid_0/s_axi]
connect_bd_intf_net [get_bd_intf_pins axi_hpm0_lpd_interconnect/M06_AXI] [get_bd_intf_pins pl_sysmon/S_AXI_LITE]
connect_bd_intf_net [get_bd_intf_pins Receiver_ip_0/AXI4_Lite] [get_bd_intf_pins axi_hpm0_lpd_interconnect/M07_AXI]
connect_bd_intf_net [get_bd_intf_pins axi_hpm0_lpd_interconnect/S00_AXI] [get_bd_intf_pins sys_ps8/M_AXI_HPM0_LPD]
connect_bd_intf_net [get_bd_intf_pins util_adc_1_pack/packed_fifo_wr] [get_bd_intf_pins axi_adrv9001_rx1_dma/fifo_wr]
connect_bd_intf_net [get_bd_intf_pins util_adc_2_pack/packed_fifo_wr] [get_bd_intf_pins axi_adrv9001_rx2_dma/fifo_wr]
connect_bd_net [get_bd_pins GND_16/dout] [get_bd_pins util_adc_2_pack/fifo_wr_data_2] [get_bd_pins util_adc_2_pack/fifo_wr_data_3]
connect_bd_net [get_bd_pins GND_1/dout] \
  [get_bd_pins sys_ps8/emio_spi0_sclk_i] [get_bd_pins sys_ps8/emio_spi0_s_i] [get_bd_pins sys_concat_intc_0/In7] \
  [get_bd_pins sys_concat_intc_0/In6] [get_bd_pins sys_concat_intc_0/In5] [get_bd_pins sys_concat_intc_0/In4] \
  [get_bd_pins sys_concat_intc_0/In3] [get_bd_pins sys_concat_intc_0/In2] [get_bd_pins sys_concat_intc_0/In1] \
  [get_bd_pins sys_concat_intc_0/In0] [get_bd_pins sys_concat_intc_1/In7] [get_bd_pins sys_concat_intc_1/In6] \
  [get_bd_pins sys_concat_intc_1/In0] [get_bd_pins util_adc_2_pack/enable_2] [get_bd_pins util_adc_2_pack/enable_3] \
  [get_bd_pins axi_adrv9001/tdd_sync]
connect_bd_net [get_bd_pins Receiver_ip_0/dut_data_out_0_rx] [get_bd_pins sync_output/data_in_rx_0]
connect_bd_net [get_bd_pins Receiver_ip_0/dut_data_out_1_rx] [get_bd_pins sync_output/data_in_rx_1]
connect_bd_net [get_bd_pins Receiver_ip_0/dut_data_out_2_rx] [get_bd_pins sync_output/data_in_rx_2]
connect_bd_net [get_bd_pins Receiver_ip_0/dut_data_out_3_rx] [get_bd_pins sync_output/data_in_rx_3]
connect_bd_net [get_bd_pins Receiver_ip_0/dut_data_valid_out_rx] [get_bd_pins sync_output/data_valid_in_rx_0]
connect_bd_net [get_bd_pins VCC_1/dout] [get_bd_pins sys_ps8/emio_spi0_ss_i_n]
connect_bd_net [get_bd_pins axi_adrv9001/adc_1_clk] \
  [get_bd_pins axi_adrv9001_rx1_dma/fifo_wr_clk] [get_bd_pins util_adc_1_pack/clk] [get_bd_pins sync_input/rx_clk] \
  [get_bd_pins sync_output/rx_clk]
connect_bd_net [get_bd_pins axi_adrv9001/adc_1_enable_i0] [get_bd_pins util_adc_1_pack/enable_0]
connect_bd_net [get_bd_pins axi_adrv9001/adc_1_enable_i1] [get_bd_pins util_adc_1_pack/enable_2]
connect_bd_net [get_bd_pins axi_adrv9001/adc_1_enable_q0] [get_bd_pins util_adc_1_pack/enable_1]
connect_bd_net [get_bd_pins axi_adrv9001/adc_1_enable_q1] [get_bd_pins util_adc_1_pack/enable_3]
connect_bd_net [get_bd_pins axi_adrv9001/adc_1_rst] [get_bd_pins util_adc_1_pack/reset] [get_bd_pins rx_rstn_inverter/Op1]
connect_bd_net [get_bd_pins axi_adrv9001/adc_1_start_sync] [get_bd_pins axi_adrv9001_rx1_dma/sync]
connect_bd_net [get_bd_pins axi_adrv9001/adc_2_clk] [get_bd_pins axi_adrv9001_rx2_dma/fifo_wr_clk] [get_bd_pins util_adc_2_pack/clk]
connect_bd_net [get_bd_pins axi_adrv9001/adc_2_data_i0] [get_bd_pins util_adc_2_pack/fifo_wr_data_0]
connect_bd_net [get_bd_pins axi_adrv9001/adc_2_data_q0] [get_bd_pins util_adc_2_pack/fifo_wr_data_1]
connect_bd_net [get_bd_pins axi_adrv9001/adc_2_enable_i0] [get_bd_pins util_adc_2_pack/enable_0]
connect_bd_net [get_bd_pins axi_adrv9001/adc_2_enable_q0] [get_bd_pins util_adc_2_pack/enable_1]
connect_bd_net [get_bd_pins axi_adrv9001/adc_2_rst] [get_bd_pins util_adc_2_pack/reset]
connect_bd_net [get_bd_pins axi_adrv9001/adc_2_start_sync] [get_bd_pins axi_adrv9001_rx2_dma/sync]
connect_bd_net [get_bd_pins axi_adrv9001/adc_2_valid_i0] [get_bd_pins util_adc_2_pack/fifo_wr_en]
connect_bd_net [get_bd_pins axi_adrv9001/dac_1_clk] \
  [get_bd_pins axi_adrv9001_tx1_dma/m_axis_aclk] [get_bd_pins util_dac_1_upack/clk] \
  [get_bd_pins axi_hpm0_lpd_interconnect/aclk1] [get_bd_pins sync_input/tx_clk] [get_bd_pins sync_output/tx_clk] \
  [get_bd_pins Receiver_ip_0/AXI4_Lite_ACLK] [get_bd_pins Receiver_ip_0/IPCORE_CLK]
connect_bd_net [get_bd_pins axi_adrv9001/dac_1_enable_i0] [get_bd_pins util_dac_1_upack/enable_0]
connect_bd_net [get_bd_pins axi_adrv9001/dac_1_enable_i1] [get_bd_pins util_dac_1_upack/enable_2]
connect_bd_net [get_bd_pins axi_adrv9001/dac_1_enable_q0] [get_bd_pins util_dac_1_upack/enable_1]
connect_bd_net [get_bd_pins axi_adrv9001/dac_1_enable_q1] [get_bd_pins util_dac_1_upack/enable_3]
connect_bd_net [get_bd_pins axi_adrv9001/dac_1_rst] [get_bd_pins util_dac_1_upack/reset] [get_bd_pins tx_rstn_inverter/Op1]
connect_bd_net [get_bd_pins axi_adrv9001/dac_2_clk] [get_bd_pins axi_adrv9001_tx2_dma/m_axis_aclk] [get_bd_pins util_dac_2_upack/clk]
connect_bd_net [get_bd_pins axi_adrv9001/dac_2_enable_i0] [get_bd_pins util_dac_2_upack/enable_0]
connect_bd_net [get_bd_pins axi_adrv9001/dac_2_enable_q0] [get_bd_pins util_dac_2_upack/enable_1]
connect_bd_net [get_bd_pins axi_adrv9001/dac_2_rst] [get_bd_pins util_dac_2_upack/reset]
connect_bd_net [get_bd_pins axi_adrv9001/dac_2_valid_i0] [get_bd_pins util_dac_2_upack/fifo_rd_en]
connect_bd_net [get_bd_pins axi_adrv9001/mcs_out] [get_bd_ports mcs_out]
connect_bd_net [get_bd_pins axi_adrv9001/mcs_src] [get_bd_ports mcs_src]
connect_bd_net [get_bd_pins axi_adrv9001_rx1_dma/irq] [get_bd_pins sys_concat_intc_1/In5]
connect_bd_net [get_bd_pins axi_adrv9001/rx1_enable] [get_bd_ports rx1_enable]
connect_bd_net [get_bd_pins axi_adrv9001_rx2_dma/irq] [get_bd_pins sys_concat_intc_1/In4]
connect_bd_net [get_bd_pins axi_adrv9001/rx2_enable] [get_bd_ports rx2_enable]
connect_bd_net [get_bd_pins axi_adrv9001/tx1_dclk_out_n_NC] [get_bd_ports tx1_dclk_out_n]
connect_bd_net [get_bd_pins axi_adrv9001/tx1_dclk_out_p_dclk_out] [get_bd_ports tx1_dclk_out_p]
connect_bd_net [get_bd_pins axi_adrv9001_tx1_dma/irq] [get_bd_pins sys_concat_intc_1/In3]
connect_bd_net [get_bd_pins axi_adrv9001/tx1_enable] [get_bd_ports tx1_enable]
connect_bd_net [get_bd_pins axi_adrv9001/tx1_idata_out_n_idata0] [get_bd_ports tx1_idata_out_n]
connect_bd_net [get_bd_pins axi_adrv9001/tx1_idata_out_p_idata1] [get_bd_ports tx1_idata_out_p]
connect_bd_net [get_bd_pins axi_adrv9001/tx1_qdata_out_n_qdata2] [get_bd_ports tx1_qdata_out_n]
connect_bd_net [get_bd_pins axi_adrv9001/tx1_qdata_out_p_qdata3] [get_bd_ports tx1_qdata_out_p]
connect_bd_net [get_bd_pins axi_adrv9001/tx1_strobe_out_n_NC] [get_bd_ports tx1_strobe_out_n]
connect_bd_net [get_bd_pins axi_adrv9001/tx1_strobe_out_p_strobe_out] [get_bd_ports tx1_strobe_out_p]
connect_bd_net [get_bd_pins axi_adrv9001/tx2_dclk_out_n_NC] [get_bd_ports tx2_dclk_out_n]
connect_bd_net [get_bd_pins axi_adrv9001/tx2_dclk_out_p_dclk_out] [get_bd_ports tx2_dclk_out_p]
connect_bd_net [get_bd_pins axi_adrv9001_tx2_dma/irq] [get_bd_pins sys_concat_intc_1/In2]
connect_bd_net [get_bd_pins axi_adrv9001/tx2_enable] [get_bd_ports tx2_enable]
connect_bd_net [get_bd_pins axi_adrv9001/tx2_idata_out_n_idata0] [get_bd_ports tx2_idata_out_n]
connect_bd_net [get_bd_pins axi_adrv9001/tx2_idata_out_p_idata1] [get_bd_ports tx2_idata_out_p]
connect_bd_net [get_bd_pins axi_adrv9001/tx2_qdata_out_n_qdata2] [get_bd_ports tx2_qdata_out_n]
connect_bd_net [get_bd_pins axi_adrv9001/tx2_qdata_out_p_qdata3] [get_bd_ports tx2_qdata_out_p]
connect_bd_net [get_bd_pins axi_adrv9001/tx2_strobe_out_n_NC] [get_bd_ports tx2_strobe_out_n]
connect_bd_net [get_bd_pins axi_adrv9001/tx2_strobe_out_p_strobe_out] [get_bd_ports tx2_strobe_out_p]
connect_bd_net [get_bd_pins axi_sysid_0/rom_addr] [get_bd_pins rom_sys_0/rom_addr]
connect_bd_net -net data_in_rx_0_1 [get_bd_pins axi_adrv9001/adc_1_data_i0] [get_bd_pins sync_input/data_in_rx_0]
connect_bd_net -net data_in_rx_1_1 [get_bd_pins axi_adrv9001/adc_1_data_i1] [get_bd_pins sync_input/data_in_rx_1]
connect_bd_net -net data_in_rx_2_1 [get_bd_pins axi_adrv9001/adc_1_data_q0] [get_bd_pins sync_input/data_in_rx_2]
connect_bd_net -net data_in_rx_3_1 [get_bd_pins axi_adrv9001/adc_1_data_q1] [get_bd_pins sync_input/data_in_rx_3]
connect_bd_net -net data_in_tx_0_1 [get_bd_pins util_dac_1_upack/fifo_rd_data_0] [get_bd_pins sync_input/data_in_tx_0]
connect_bd_net -net data_in_tx_1_1 [get_bd_pins util_dac_1_upack/fifo_rd_data_1] [get_bd_pins sync_input/data_in_tx_1]
connect_bd_net -net data_in_tx_2_1 [get_bd_pins util_dac_1_upack/fifo_rd_data_2] [get_bd_pins sync_input/data_in_tx_2]
connect_bd_net -net data_in_tx_3_1 [get_bd_pins util_dac_1_upack/fifo_rd_data_3] [get_bd_pins sync_input/data_in_tx_3]
connect_bd_net -net data_valid_in_rx_0_1 [get_bd_pins axi_adrv9001/adc_1_valid_i0] [get_bd_pins sync_input/data_valid_in_rx_0]
connect_bd_net -net data_valid_in_tx_0_1 [get_bd_pins axi_adrv9001/dac_1_valid_i0] [get_bd_pins sync_input/data_valid_in_tx_0]
connect_bd_net [get_bd_ports gpio_i] [get_bd_pins sys_ps8/emio_gpio_i]
connect_bd_net [get_bd_ports gpio_rx1_enable_in] [get_bd_pins axi_adrv9001/gpio_rx1_enable_in]
connect_bd_net [get_bd_ports gpio_rx2_enable_in] [get_bd_pins axi_adrv9001/gpio_rx2_enable_in]
connect_bd_net [get_bd_ports gpio_tx1_enable_in] [get_bd_pins axi_adrv9001/gpio_tx1_enable_in]
connect_bd_net [get_bd_ports gpio_tx2_enable_in] [get_bd_pins axi_adrv9001/gpio_tx2_enable_in]
connect_bd_net [get_bd_ports mcs_in] [get_bd_pins axi_adrv9001/mcs_in]
connect_bd_net [get_bd_ports mssi_sync] [get_bd_pins axi_adrv9001/mssi_sync_in]
connect_bd_net [get_bd_pins pl_sysmon/ip2intc_irpt] [get_bd_pins sys_concat_intc_1/In1]
connect_bd_net [get_bd_ports ref_clk] [get_bd_pins axi_adrv9001/ref_clk]
connect_bd_net [get_bd_pins rom_sys_0/rom_data] [get_bd_pins axi_sysid_0/sys_rom_data]
connect_bd_net [get_bd_ports rx1_dclk_in_n] [get_bd_pins axi_adrv9001/rx1_dclk_in_n_NC]
connect_bd_net [get_bd_ports rx1_dclk_in_p] [get_bd_pins axi_adrv9001/rx1_dclk_in_p_dclk_in]
connect_bd_net [get_bd_ports rx1_idata_in_n] [get_bd_pins axi_adrv9001/rx1_idata_in_n_idata0]
connect_bd_net [get_bd_ports rx1_idata_in_p] [get_bd_pins axi_adrv9001/rx1_idata_in_p_idata1]
connect_bd_net [get_bd_ports rx1_qdata_in_n] [get_bd_pins axi_adrv9001/rx1_qdata_in_n_qdata2]
connect_bd_net [get_bd_ports rx1_qdata_in_p] [get_bd_pins axi_adrv9001/rx1_qdata_in_p_qdata3]
connect_bd_net [get_bd_ports rx1_strobe_in_n] [get_bd_pins axi_adrv9001/rx1_strobe_in_n_NC]
connect_bd_net [get_bd_ports rx1_strobe_in_p] [get_bd_pins axi_adrv9001/rx1_strobe_in_p_strobe_in]
connect_bd_net [get_bd_ports rx2_dclk_in_n] [get_bd_pins axi_adrv9001/rx2_dclk_in_n_NC]
connect_bd_net [get_bd_ports rx2_dclk_in_p] [get_bd_pins axi_adrv9001/rx2_dclk_in_p_dclk_in]
connect_bd_net [get_bd_ports rx2_idata_in_n] [get_bd_pins axi_adrv9001/rx2_idata_in_n_idata0]
connect_bd_net [get_bd_ports rx2_idata_in_p] [get_bd_pins axi_adrv9001/rx2_idata_in_p_idata1]
connect_bd_net [get_bd_ports rx2_qdata_in_n] [get_bd_pins axi_adrv9001/rx2_qdata_in_n_qdata2]
connect_bd_net [get_bd_ports rx2_qdata_in_p] [get_bd_pins axi_adrv9001/rx2_qdata_in_p_qdata3]
connect_bd_net [get_bd_ports rx2_strobe_in_n] [get_bd_pins axi_adrv9001/rx2_strobe_in_n_NC]
connect_bd_net [get_bd_ports rx2_strobe_in_p] [get_bd_pins axi_adrv9001/rx2_strobe_in_p_strobe_in]
connect_bd_net [get_bd_pins rx_rstn_inverter/Res] [get_bd_pins sync_input/rx_rstn] [get_bd_pins sync_output/rx_rstn]
connect_bd_net [get_bd_ports s_0v85_mgtravcc_sns_n] [get_bd_pins pl_sysmon/vauxn7]
connect_bd_net [get_bd_ports s_0v85_mgtravcc_sns_p] [get_bd_pins pl_sysmon/vauxp7]
connect_bd_net [get_bd_ports s_1p0_rf_sns_n] [get_bd_pins pl_sysmon/vauxn3]
connect_bd_net [get_bd_ports s_1p0_rf_sns_p] [get_bd_pins pl_sysmon/vauxp3]
connect_bd_net [get_bd_ports s_1p3_rf_sns_n] [get_bd_pins pl_sysmon/vauxn2]
connect_bd_net [get_bd_ports s_1p3_rf_sns_p] [get_bd_pins pl_sysmon/vauxp2]
connect_bd_net [get_bd_ports s_1p8_rf_sns_n] [get_bd_pins pl_sysmon/vauxn10]
connect_bd_net [get_bd_ports s_1p8_rf_sns_p] [get_bd_pins pl_sysmon/vauxp10]
connect_bd_net [get_bd_ports s_1v2_ps_ddr4_sns_n] [get_bd_pins pl_sysmon/vauxn0]
connect_bd_net [get_bd_ports s_1v2_ps_ddr4_sns_p] [get_bd_pins pl_sysmon/vauxp0]
connect_bd_net [get_bd_ports s_1v2_sns_n] [get_bd_pins pl_sysmon/vauxn5]
connect_bd_net [get_bd_ports s_1v2_sns_p] [get_bd_pins pl_sysmon/vauxp5]
connect_bd_net [get_bd_ports s_1v8_mgtravtt_sns_n] [get_bd_pins pl_sysmon/vauxn4]
connect_bd_net [get_bd_ports s_1v8_mgtravtt_sns_p] [get_bd_pins pl_sysmon/vauxp4]
connect_bd_net [get_bd_ports s_2v5_sns_n] [get_bd_pins pl_sysmon/vauxn1]
connect_bd_net [get_bd_ports s_2v5_sns_p] [get_bd_pins pl_sysmon/vauxp1]
connect_bd_net [get_bd_ports s_5v0_rf_sns_n] [get_bd_pins pl_sysmon/vauxn9]
connect_bd_net [get_bd_ports s_5v0_rf_sns_p] [get_bd_pins pl_sysmon/vauxp9]
connect_bd_net [get_bd_ports s_5v0_sns_n] [get_bd_pins pl_sysmon/vauxn6]
connect_bd_net [get_bd_ports s_5v0_sns_p] [get_bd_pins pl_sysmon/vauxp6]
connect_bd_net [get_bd_ports s_vtt_ps_ddr4_sns_n] [get_bd_pins pl_sysmon/vauxn8]
connect_bd_net [get_bd_ports s_vtt_ps_ddr4_sns_p] [get_bd_pins pl_sysmon/vauxp8]
connect_bd_net [get_bd_ports spi0_miso] [get_bd_pins sys_ps8/emio_spi0_m_i]
connect_bd_net [get_bd_pins sync_input/data_out_rx_0] [get_bd_pins Receiver_ip_0/dut_data_in_0_rx]
connect_bd_net [get_bd_pins sync_input/data_out_rx_1] [get_bd_pins Receiver_ip_0/dut_data_in_1_rx]
connect_bd_net [get_bd_pins sync_input/data_valid_out_rx_0] [get_bd_pins Receiver_ip_0/dut_data_valid_in_rx]
connect_bd_net [get_bd_pins sync_output/data_out_rx_0] [get_bd_pins util_adc_1_pack/fifo_wr_data_0]
connect_bd_net [get_bd_pins sync_output/data_out_rx_1] [get_bd_pins util_adc_1_pack/fifo_wr_data_1]
connect_bd_net [get_bd_pins sync_output/data_out_rx_2] [get_bd_pins util_adc_1_pack/fifo_wr_data_2]
connect_bd_net [get_bd_pins sync_output/data_out_rx_3] [get_bd_pins util_adc_1_pack/fifo_wr_data_3]
connect_bd_net [get_bd_pins sync_output/data_out_tx_0] [get_bd_pins axi_adrv9001/dac_1_data_i0]
connect_bd_net [get_bd_pins sync_output/data_out_tx_1] [get_bd_pins axi_adrv9001/dac_1_data_i1]
connect_bd_net [get_bd_pins sync_output/data_out_tx_2] [get_bd_pins axi_adrv9001/dac_1_data_q0]
connect_bd_net [get_bd_pins sync_output/data_out_tx_3] [get_bd_pins axi_adrv9001/dac_1_data_q1]
connect_bd_net [get_bd_pins sync_output/data_valid_out_rx_0] [get_bd_pins util_adc_1_pack/fifo_wr_en]
connect_bd_net [get_bd_pins sync_output/data_valid_out_tx_0] [get_bd_pins util_dac_1_upack/fifo_rd_en]
connect_bd_net -net sys_250m_clk [get_bd_pins sys_ps8/pl_clk1] \
  [get_bd_pins sys_250m_rstgen/slowest_sync_clk] [get_bd_pins axi_hpc0_interconnect/aclk] \
  [get_bd_pins sys_ps8/saxihpc0_fpd_aclk] [get_bd_pins axi_adrv9001_rx1_dma/m_dest_axi_aclk] \
  [get_bd_pins axi_adrv9001_rx2_dma/m_dest_axi_aclk] [get_bd_pins axi_adrv9001_tx1_dma/m_src_axi_aclk] \
  [get_bd_pins axi_adrv9001_tx2_dma/m_src_axi_aclk]
# net sys_250m_reset has one end: sys_250m_rstgen/peripheral_reset
connect_bd_net -net sys_250m_resetn [get_bd_pins sys_250m_rstgen/peripheral_aresetn] \
  [get_bd_pins axi_hpc0_interconnect/aresetn] [get_bd_pins axi_adrv9001_rx1_dma/m_dest_axi_aresetn] \
  [get_bd_pins axi_adrv9001_rx2_dma/m_dest_axi_aresetn] [get_bd_pins axi_adrv9001_tx1_dma/m_src_axi_aresetn] \
  [get_bd_pins axi_adrv9001_tx2_dma/m_src_axi_aresetn]
connect_bd_net -net sys_500m_clk [get_bd_pins sys_ps8/pl_clk2] [get_bd_pins sys_500m_rstgen/slowest_sync_clk] [get_bd_pins axi_adrv9001/delay_clk]
# net sys_500m_reset has one end: sys_500m_rstgen/peripheral_reset
# net sys_500m_resetn has one end: sys_500m_rstgen/peripheral_aresetn
connect_bd_net [get_bd_pins sys_concat_intc_0/dout] [get_bd_pins sys_ps8/pl_ps_irq0]
connect_bd_net [get_bd_pins sys_concat_intc_1/dout] [get_bd_pins sys_ps8/pl_ps_irq1]
connect_bd_net -net sys_cpu_clk [get_bd_pins sys_ps8/pl_clk0] \
  [get_bd_pins sys_rstgen/slowest_sync_clk] [get_bd_pins rom_sys_0/clk] [get_bd_pins pl_sysmon/s_axi_aclk] \
  [get_bd_pins axi_hpm0_lpd_interconnect/aclk] [get_bd_pins sys_ps8/maxihpm0_lpd_aclk] [get_bd_pins axi_adrv9001/s_axi_aclk] \
  [get_bd_pins axi_adrv9001_rx1_dma/s_axi_aclk] [get_bd_pins axi_adrv9001_rx2_dma/s_axi_aclk] \
  [get_bd_pins axi_adrv9001_tx1_dma/s_axi_aclk] [get_bd_pins axi_adrv9001_tx2_dma/s_axi_aclk] \
  [get_bd_pins axi_sysid_0/s_axi_aclk]
# net sys_cpu_reset has one end: sys_rstgen/peripheral_reset
connect_bd_net -net sys_cpu_resetn [get_bd_pins sys_rstgen/peripheral_aresetn] \
  [get_bd_pins pl_sysmon/s_axi_aresetn] [get_bd_pins axi_hpm0_lpd_interconnect/aresetn] \
  [get_bd_pins axi_adrv9001/s_axi_aresetn] [get_bd_pins axi_adrv9001_rx1_dma/s_axi_aresetn] \
  [get_bd_pins axi_adrv9001_rx2_dma/s_axi_aresetn] [get_bd_pins axi_adrv9001_tx1_dma/s_axi_aresetn] \
  [get_bd_pins axi_adrv9001_tx2_dma/s_axi_aresetn] [get_bd_pins axi_sysid_0/s_axi_aresetn]
connect_bd_net [get_bd_pins sys_ps8/emio_gpio_o] [get_bd_ports gpio_o]
connect_bd_net [get_bd_pins sys_ps8/emio_gpio_t] [get_bd_ports gpio_t]
connect_bd_net [get_bd_pins sys_ps8/emio_spi0_m_o] [get_bd_ports spi0_mosi]
connect_bd_net [get_bd_pins sys_ps8/emio_spi0_sclk_o] [get_bd_ports spi0_sclk]
connect_bd_net [get_bd_pins sys_ps8/emio_spi0_ss_o_n] [get_bd_ports spi0_csn]
connect_bd_net [get_bd_pins sys_ps8/pl_resetn0] \
  [get_bd_pins sys_rstgen/ext_reset_in] [get_bd_pins sys_250m_rstgen/ext_reset_in] [get_bd_pins sys_500m_rstgen/ext_reset_in]
connect_bd_net [get_bd_ports tx1_dclk_in_n] [get_bd_pins axi_adrv9001/tx1_dclk_in_n_NC]
connect_bd_net [get_bd_ports tx1_dclk_in_p] [get_bd_pins axi_adrv9001/tx1_dclk_in_p_dclk_in]
connect_bd_net [get_bd_ports tx2_dclk_in_n] [get_bd_pins axi_adrv9001/tx2_dclk_in_n_NC]
connect_bd_net [get_bd_ports tx2_dclk_in_p] [get_bd_pins axi_adrv9001/tx2_dclk_in_p_dclk_in]
